# EAGLE design XRP_Controller (EAGLE 9.6.2)
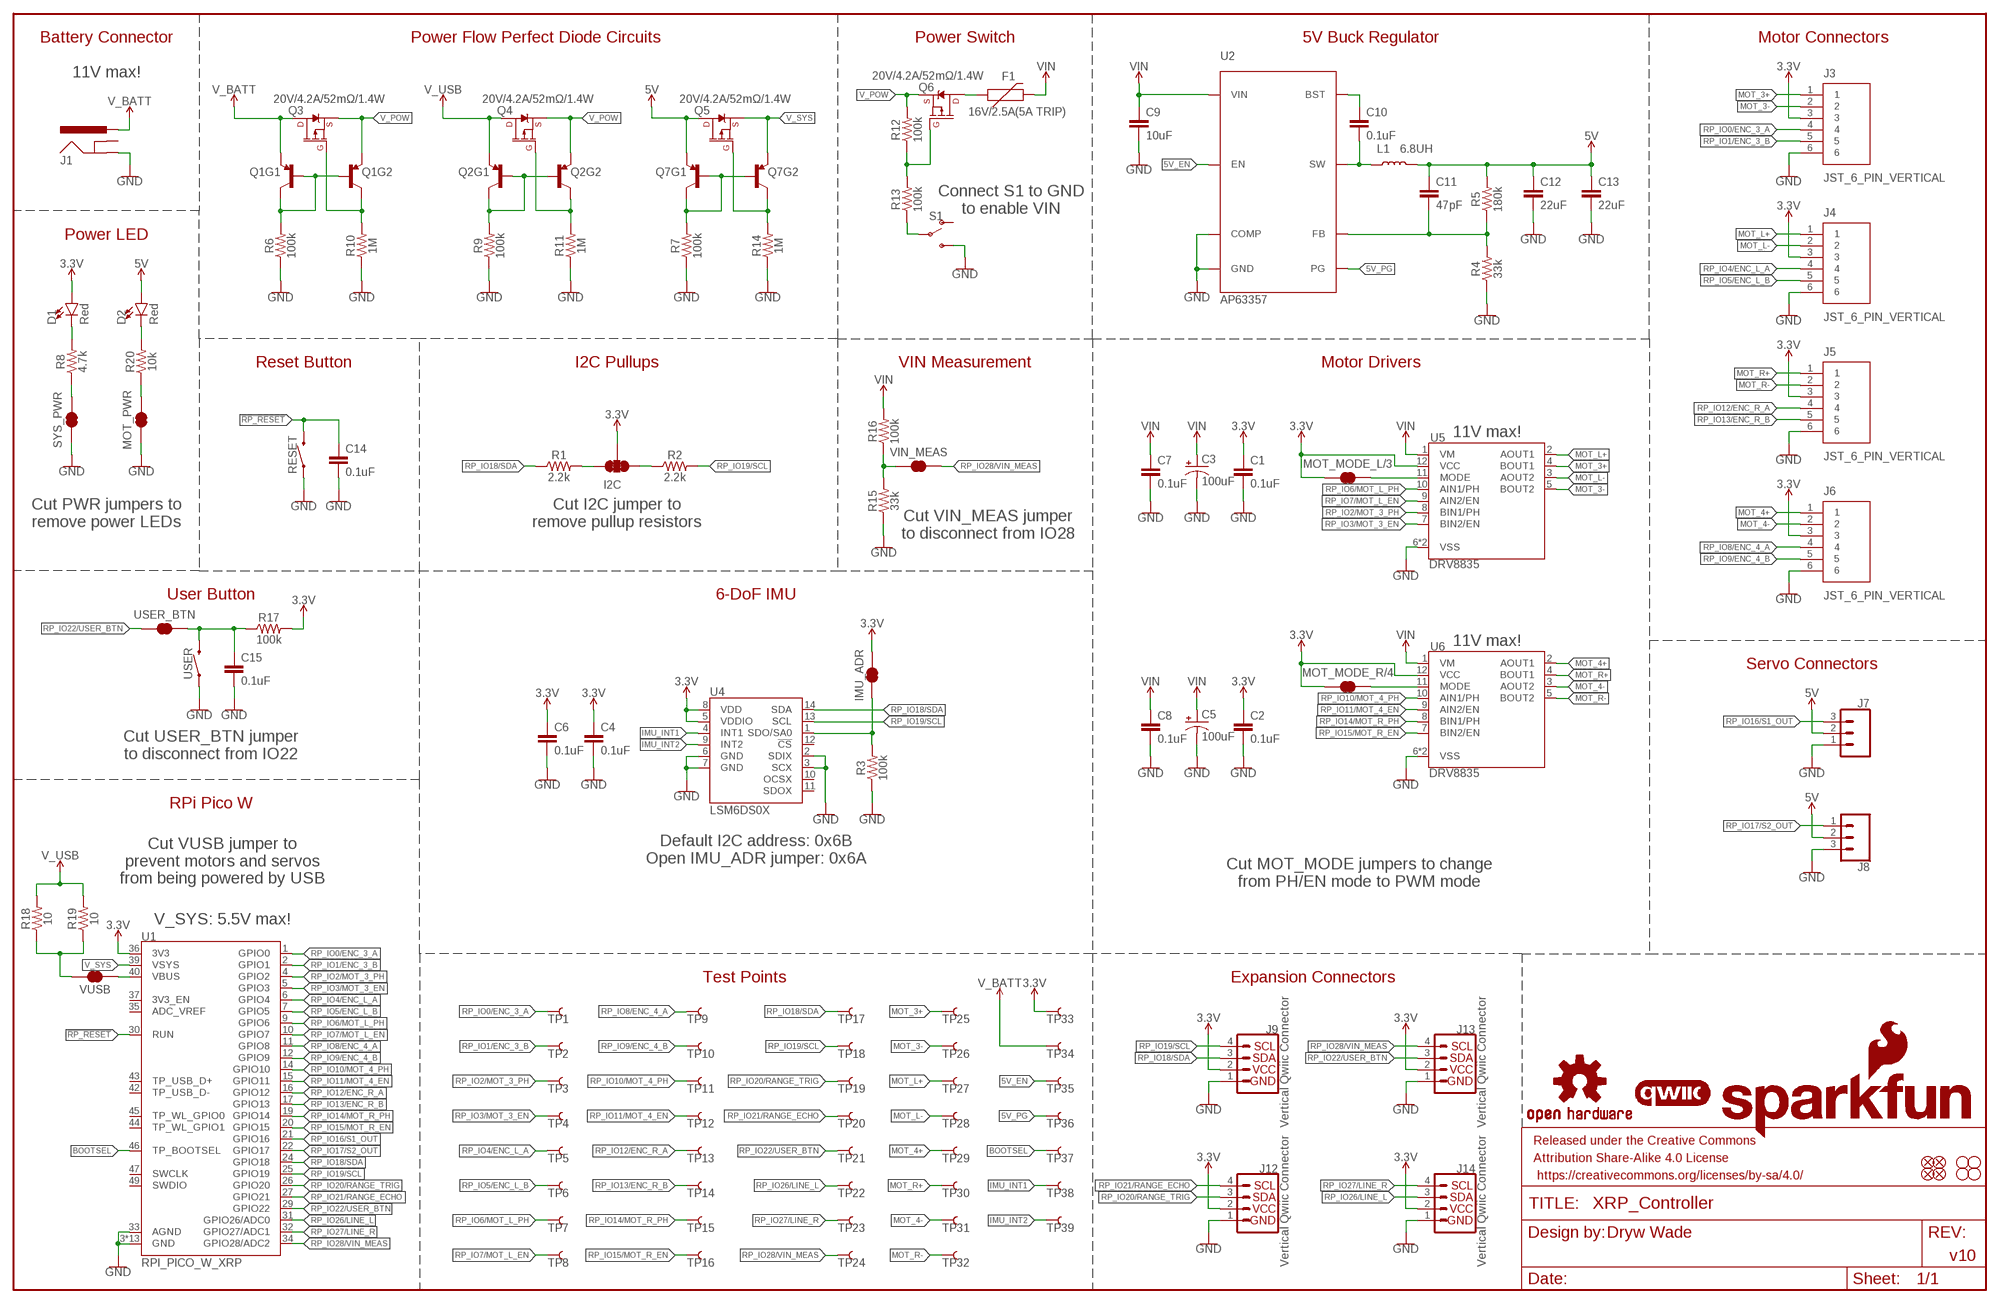
[diagram p0: schematic, sheet 1]

## Parts
C1  0.1uF  0.1UF-0603-25V-(+80/-20%)  [0603]
C2  0.1uF  0.1UF-0603-25V-(+80/-20%)  [0603]
C3  100uF  100UF-POLAR-25V-20%-SMD(ELEC)  [PANASONIC_D]
C4  0.1uF  0.1UF-0603-25V-(+80/-20%)  [0603]
C5  100uF  100UF-POLAR-25V-20%-SMD(ELEC)  [PANASONIC_D]
C6  0.1uF  0.1UF-0603-25V-(+80/-20%)  [0603]
C7  0.1uF  0.1UF-0603-25V-(+80/-20%)  [0603]
C8  0.1uF  0.1UF-0603-25V-(+80/-20%)  [0603]
C9  10uF  10UF-0805-25V-10%  [0805]
C10  0.1uF  0.1UF-0603-25V-(+80/-20%)  [0603]
C11  47pF  47PF-0603-50V-5%  [0603]
C12  22uF  22UF-0805-16V-20%  [0805]
C13  22uF  22UF-0805-16V-20%  [0805]
C14  0.1uF  0.1UF-0603-25V-(+80/-20%)  [0603]
C15  0.1uF  0.1UF-0603-25V-(+80/-20%)  [0603]
D1  Red  LED-RED_0603-KB  [LED-0603]
D2  Red  LED-RED_0603-KB  [LED-0603]
F1  16V/2.5A(5A TRIP)  PPTC_16V_2.5A  [1812]
FD1  FIDUCIAL1X2  [FIDUCIAL-1X2]
FD2  FIDUCIAL1X2  [FIDUCIAL-1X2]
FD3  FIDUCIAL1X2  [FIDUCIAL-1X2]
FD4  FIDUCIAL1X2  [FIDUCIAL-1X2]
FRAME1  FRAME-LEDGER  [CREATIVE_COMMONS]
H1  STAND-OFF  [STAND-OFF]
H2  STAND-OFF  [STAND-OFF]
H3  STAND-OFF  [STAND-OFF]
H4  STAND-OFF  [STAND-OFF]
I2C  JUMPER-SMT_3_2-NC_TRACE_SILK  [SMT-JUMPER_3_2-NC_TRACE_SILK]
IMU_ADR  JUMPER-SMT_2_NC_TRACE_SILK  [SMT-JUMPER_2_NC_TRACE_SILK]
J1  POWER_JACKPOWER_JACK_SLOT  [POWER_JACK_PTH_SLOT]
J3  JST_6_PIN_VERTICAL  [JST-6-SMD-VERT-1.0MM]
J4  JST_6_PIN_VERTICAL  [JST-6-SMD-VERT-1.0MM]
J5  JST_6_PIN_VERTICAL  [JST-6-SMD-VERT-1.0MM]
J6  JST_6_PIN_VERTICAL  [JST-6-SMD-VERT-1.0MM]
J7  CONN_03LOCK_NO_SILK  [1X03_LOCK_NO_SILK]
J8  CONN_03LOCK_NO_SILK  [1X03_LOCK_NO_SILK]
J9  Vertical Qwiic Connector  QWIIC_CONNECTOR  [JST04_1MM_VERT]
J12  Vertical Qwiic Connector  QWIIC_CONNECTOR  [JST04_1MM_VERT]
J13  Vertical Qwiic Connector  QWIIC_CONNECTOR  [JST04_1MM_VERT]
J14  Vertical Qwiic Connector  QWIIC_CONNECTOR  [JST04_1MM_VERT]
L1  6.8UH  [07A7_6U8H]
LOGO1  OSHW-LOGOS  [OSHW-LOGO-S]
LOGO3  SFE_LOGO_NAME_FLAME.3_INCH  [SFE_LOGO_NAME_FLAME_.3]
MOT_MODE_L/3  JUMPER-SMT_2_NC_TRACE_SILK  [SMT-JUMPER_2_NC_TRACE_SILK]
MOT_MODE_R/4  JUMPER-SMT_2_NC_TRACE_SILK  [SMT-JUMPER_2_NC_TRACE_SILK]
MOT_PWR  JUMPER-SMT_2_NC_TRACE_SILK  [SMT-JUMPER_2_NC_TRACE_SILK]
Q1  TRANS_PNP_DUALSOT-363  [SOT363_PHILIPS]
Q2  TRANS_PNP_DUALSOT-363  [SOT363_PHILIPS]
Q3  20V/4.2A/52mΩ/1.4W  MOSFET_PCH-DMG2305UX-7  [SOT23-3]
Q4  20V/4.2A/52mΩ/1.4W  MOSFET_PCH-DMG2305UX-7  [SOT23-3]
Q5  20V/4.2A/52mΩ/1.4W  MOSFET_PCH-DMG2305UX-7  [SOT23-3]
Q6  20V/4.2A/52mΩ/1.4W  MOSFET_PCH-DMG2305UX-7  [SOT23-3]
Q7  TRANS_PNP_DUALSOT-363  [SOT363_PHILIPS]
R1  2.2k  2.2KOHM-0603-1/10W-1%  [0603]
R2  2.2k  2.2KOHM-0603-1/10W-1%  [0603]
R3  100k  100KOHM-0603-1/10W-1%  [0603]
R4  33k  33KOHM-0603-1/10W-1%  [0603]
R5  180k  180KOHM-0603-1/10W-1%  [0603]
R6  100k  100KOHM-0603-1/10W-1%  [0603]
R7  100k  100KOHM-0603-1/10W-1%  [0603]
R8  4.7k  4.7KOHM-0603-1/10W-1%  [0603]
R9  100k  100KOHM-0603-1/10W-1%  [0603]
R10  1M  1MOHM-0603-1/4W-5%  [0603]
R11  1M  1MOHM-0603-1/4W-5%  [0603]
R12  100k  100KOHM-0603-1/10W-1%  [0603]
R13  100k  100KOHM-0603-1/10W-1%  [0603]
R14  1M  1MOHM-0603-1/4W-5%  [0603]
R15  33k  33KOHM-0603-1/10W-1%  [0603]
R16  100k  100KOHM-0603-1/10W-1%  [0603]
R17  100k  100KOHM-0603-1/10W-1%  [0603]
R18  10  10OHM-1206-1/4W-1%  [1206]
R19  10  10OHM-1206-1/4W-1%  [1206]
R20  10k  10KOHM-0603-1/10W-1%  [0603]
RESET  MOMENTARY-SWITCH-SPST-SMD-4.6X2.8MM  [TACTILE_SWITCH_SMD_4.6X2.8MM]
S1  SWITCH-SPDT-SMD-RIGHT-ANGLE  [SWITCH_SPST_SMD_A]
SYS_PWR  JUMPER-SMT_2_NC_TRACE_SILK  [SMT-JUMPER_2_NC_TRACE_SILK]
TP1  TEST-POINT3X5  [PAD.03X.05]
TP2  TEST-POINT3X5  [PAD.03X.05]
TP3  TEST-POINT3X5  [PAD.03X.05]
TP4  TEST-POINT3X5  [PAD.03X.05]
TP5  TEST-POINT3X5  [PAD.03X.05]
TP6  TEST-POINT3X5  [PAD.03X.05]
TP7  TEST-POINT3X5  [PAD.03X.05]
TP8  TEST-POINT3X5  [PAD.03X.05]
TP9  TEST-POINT3X5  [PAD.03X.05]
TP10  TEST-POINT3X5  [PAD.03X.05]
TP11  TEST-POINT3X5  [PAD.03X.05]
TP12  TEST-POINT3X5  [PAD.03X.05]
TP13  TEST-POINT3X5  [PAD.03X.05]
TP14  TEST-POINT3X5  [PAD.03X.05]
TP15  TEST-POINT3X5  [PAD.03X.05]
TP16  TEST-POINT3X5  [PAD.03X.05]
TP17  TEST-POINT3X5  [PAD.03X.05]
TP18  TEST-POINT3X5  [PAD.03X.05]
TP19  TEST-POINT3X5  [PAD.03X.05]
TP20  TEST-POINT3X5  [PAD.03X.05]
TP21  TEST-POINT3X5  [PAD.03X.05]
TP22  TEST-POINT3X5  [PAD.03X.05]
TP23  TEST-POINT3X5  [PAD.03X.05]
TP24  TEST-POINT3X5  [PAD.03X.05]
TP25  TEST-POINT3X5  [PAD.03X.05]
TP26  TEST-POINT3X5  [PAD.03X.05]
TP27  TEST-POINT3X5  [PAD.03X.05]
TP28  TEST-POINT3X5  [PAD.03X.05]
TP29  TEST-POINT3X5  [PAD.03X.05]
TP30  TEST-POINT3X5  [PAD.03X.05]
TP31  TEST-POINT3X5  [PAD.03X.05]
TP32  TEST-POINT3X5  [PAD.03X.05]
TP33  TEST-POINT3X5  [PAD.03X.05]
TP34  TEST-POINT3X5  [PAD.03X.05]
TP35  TEST-POINT3X5  [PAD.03X.05]
TP36  TEST-POINT3X5  [PAD.03X.05]
TP37  TEST-POINT3X5  [PAD.03X.05]
TP38  TEST-POINT3X5  [PAD.03X.05]
TP39  TEST-POINT3X5  [PAD.03X.05]
U1  RPI_PICO_W_XRP  [RPI_PICO_W]
U2  AP63357  [V-DFN3020-13]
U4  LSM6DS0X  LSM6DSOX_XRP  [LGA14L]
U5  DRV8835  DRV883X  [WSON-12]
U6  DRV8835  DRV883X  [WSON-12]
U$98  QWIIC_LOGO  [QWIIC_INVERTED]
USER  MOMENTARY-SWITCH-SPST-SMD-4.6X2.8MM  [TACTILE_SWITCH_SMD_4.6X2.8MM]
USER_BTN  JUMPER-SMT_2_NC_TRACE_SILK  [SMT-JUMPER_2_NC_TRACE_SILK]
VIN_MEAS  JUMPER-SMT_2_NC_TRACE_SILK  [SMT-JUMPER_2_NC_TRACE_SILK]
VUSB  JUMPER-SMT_2_NC_TRACE_SILK  [SMT-JUMPER_2_NC_TRACE_SILK]

## Nets
3.3V: C1.1 C2.1 C4.1 C6.1 D1.A I2C.2 IMU_ADR.2 J3.3 J4.3 J5.3 J6.3 J9.2 J12.2 J13.2 J14.2 MOT_MODE_L/3.2 MOT_MODE_R/4.2 R17.2 TP33.1 U1.36(3V3) U4.5(VDDIO) U4.8(VDD) U5.12(VCC) U6.12(VCC)
5V: C11.1 C12.1 C13.1 D2.A J7.2 J8.2 L1.P$2 Q5.3(D) Q7.1(E) R5.2
5V_EN: TP35.1 U2.P$2(EN)
5V_PG: TP36.1 U2.P$5(PG)
!POW_EN!: R13.1 S1.2(P)
!RP_RESET!: C14.1 RESET.3 RESET.4 U1.30(RUN)
BOOTSEL: TP37.1 U1.46(TP_BOOTSEL)
FB: C11.2 R4.2 R5.1 U2.P$3(FB)
GND: C1.2 C2.2 C3.- C4.2 C5.- C6.2 C7.2 C8.2 C9.2 C12.2 C13.2 C14.2 C15.2 J1.GND J3.6 J4.6 J5.6 J6.6 J7.1 J8.3 J9.1 J12.1 J13.1 J14.1 MOT_PWR.1 R3.1 R4.1 R6.1 R7.1 R9.1 R10.1 R11.1 R14.1 R15.1 RESET.1 RESET.2 S1.3(S) SYS_PWR.1 U1.3(GND) U1.8(GND) U1.13(GND) U1.18(GND) U1.23(GND) U1.28(GND) U1.33(AGND) U1.38(GND) U1.41(GND) U1.48(GND) U1.A(GND) U1.B(GND) U1.C(GND) U1.D(GND) U2.P$4(COMP) U2.P$8(GND) U4.2(SDIX) U4.3(SCX) U4.6(GND) U4.7(GND) U5.6(VSS) U5.PAD(VSS) U6.6(VSS) U6.PAD(VSS) USER.1 USER.2
IMU_INT1: TP38.1 U4.4(INT1)
IMU_INT2: TP39.1 U4.9(INT2)
MOT_3+: J3.1 TP25.1 U5.4(BOUT1)
MOT_3-: J3.2 TP26.1 U5.5(BOUT2)
MOT_4+: J6.1 TP29.1 U6.2(AOUT1)
MOT_4-: J6.2 TP31.1 U6.3(AOUT2)
MOT_L+: J4.1 TP27.1 U5.2(AOUT1)
MOT_L-: J4.2 TP28.1 U5.3(AOUT2)
MOT_R+: J5.1 TP30.1 U6.4(BOUT1)
MOT_R-: J5.2 TP32.1 U6.5(BOUT2)
N$1: D1.C R8.2
N$2: IMU_ADR.1 R3.2 U4.1(SDO/SA0)
N$3: I2C.3 R1.2
N$4: I2C.1 R2.1
N$5: C10.1 U2.P$6(BST)
N$6: Q1.2(B) Q1.5(B) Q1.6(C) R6.2
N$7: Q1.3(C) Q3.1(G) R10.2
N$8: F1.1 Q6.3(D)
N$9: U1.40(VBUS) VUSB.2
N$10: R8.1 SYS_PWR.2
N$11: Q2.2(B) Q2.5(B) Q2.6(C) R9.2
N$12: R15.2 R16.1 VIN_MEAS.2
N$13: MOT_MODE_L/3.1 U5.11(MODE)
N$14: MOT_MODE_R/4.1 U6.11(MODE)
N$15: Q6.1(G) R12.1 R13.2
N$16: Q2.3(C) Q4.1(G) R11.2
N$17: C15.1 R17.1 USER.3 USER.4 USER_BTN.1
N$18: R18.1 R19.1 VUSB.1
N$19: Q7.2(B) Q7.5(B) Q7.6(C) R7.2
N$20: Q5.1(G) Q7.3(C) R14.2
N$21: D2.C R20.2
N$22: MOT_PWR.2 R20.1
RP_IO0/ENC_3_A: J3.4 TP1.1 U1.1(GPIO0)
RP_IO1/ENC_3_B: J3.5 TP2.1 U1.2(GPIO1)
RP_IO2/MOT_3_PH: TP3.1 U1.4(GPIO2) U5.8(BIN1/PH)
RP_IO3/MOT_3_EN: TP4.1 U1.5(GPIO3) U5.7(BIN2/EN)
RP_IO4/ENC_L_A: J4.4 TP5.1 U1.6(GPIO4)
RP_IO5/ENC_L_B: J4.5 TP6.1 U1.7(GPIO5)
RP_IO6/MOT_L_PH: TP7.1 U1.9(GPIO6) U5.10(AIN1/PH)
RP_IO7/MOT_L_EN: TP8.1 U1.10(GPIO7) U5.9(AIN2/EN)
RP_IO8/ENC_4_A: J6.4 TP9.1 U1.11(GPIO8)
RP_IO9/ENC_4_B: J6.5 TP10.1 U1.12(GPIO9)
RP_IO10/MOT_4_PH: TP11.1 U1.14(GPIO10) U6.10(AIN1/PH)
RP_IO11/MOT_4_EN: TP12.1 U1.15(GPIO11) U6.9(AIN2/EN)
RP_IO12/ENC_R_A: J5.4 TP13.1 U1.16(GPIO12)
RP_IO13/ENC_R_B: J5.5 TP14.1 U1.17(GPIO13)
RP_IO14/MOT_R_PH: TP15.1 U1.19(GPIO14) U6.8(BIN1/PH)
RP_IO15/MOT_R_EN: TP16.1 U1.20(GPIO15) U6.7(BIN2/EN)
RP_IO16/S1_OUT: J7.3 U1.21(GPIO16)
RP_IO17/S2_OUT: J8.1 U1.22(GPIO17)
RP_IO18/SDA: J9.3 R1.1 TP17.1 U1.24(GPIO18) U4.14(SDA)
RP_IO19/SCL: J9.4 R2.2 TP18.1 U1.25(GPIO19) U4.13(SCL)
RP_IO20/RANGE_TRIG: J12.3 TP19.1 U1.26(GPIO20)
RP_IO21/RANGE_ECHO: J12.4 TP20.1 U1.27(GPIO21)
RP_IO22/USER_BTN: J13.3 TP21.1 U1.29(GPIO22) USER_BTN.2
RP_IO26/LINE_L: J14.3 TP22.1 U1.31(GPIO26/ADC0)
RP_IO27/LINE_R: J14.4 TP23.1 U1.32(GPIO27/ADC1)
RP_IO28/VIN_MEAS: J13.4 TP24.1 U1.34(GPIO28/ADC2) VIN_MEAS.1
SW: C10.2 L1.P$1 U2.P$7(SW) U2.P$9(SW)
V_BATT: J1.PWR Q1.1(E) Q3.3(D) TP34.1
V_POW: Q1.4(E) Q2.4(E) Q3.2(S) Q4.2(S) Q6.2(S) R12.2
V_SYS: Q5.2(S) Q7.4(E) U1.39(VSYS)
V_USB: Q2.1(E) Q4.3(D) R18.2 R19.2
VIN: C3.+ C5.+ C7.1 C8.1 C9.1 F1.2 R16.2 U2.P$1(VIN) U5.1(VM) U6.1(VM)
Unconnected: J1.GNDBREAK S1.1(O) U1.35(ADC_VREF) U1.37(3V3_EN) U1.42(TP_USB_D-) U1.43(TP_USB_D+) U1.44(TP_WL_GPIO1) U1.45(TP_WL_GPIO0) U1.47(SWCLK) U1.49(SWDIO) U4.10(OCSX) U4.11(SDOX) U4.12(!CS!)

## Notes on the sheet
- Battery Connector | Power Flow Perfect Diode Circuits | Power Switch | 5V Buck Regulator | Motor Connectors
- 11V max!
- Connect S1 to GND
  to enable VIN
- Power LED
- Reset Button | I2C Pullups | VIN Measurement | Motor Drivers
- 11V max!
- Cut PWR jumpers to
  remove power LEDs
- Cut I2C jumper to
  remove pullup resistors
- Cut VIN_MEAS jumper
  to disconnect from IO28
- User Button | 6-DoF IMU
- 11V max!
- Servo Connectors
- Cut USER_BTN jumper
  to disconnect from IO22
- RPi Pico W
- Default I2C address: 0x6B
  Open IMU_ADR jumper: 0x6A
- Cut VUSB jumper to
  prevent motors and servos
  from being powered by USB
- Cut MOT_MODE jumpers to change
  from PH/EN mode to PWM mode
- V_SYS: 5.5V max!
- Test Points | Expansion Connectors
- Dryw Wade
- v10

## Library data of the parts
C1 C2 C4 C6-C8 C10 C14 C15 = SparkFun-Capacitors:0.1UF: 0.1µF ceramic capacitors A capacitor is a passive two-terminal electrical component used to store electrical energy temporarily in an electric field.; PROD_ID: CAP-00810
C3 C5 = SparkFun-Capacitors:100UF-POLAR: 100µF polarized capacitors A capacitor is a passive two-terminal electrical component used to store electrical energy temporarily in an electric field.; PN: EDH107M025A9HAA; PROD_ID: CAP-17222
C9 = SparkFun-Capacitors:10UF: 10.0µF ceramic capacitors A capacitor is a passive two-terminal electrical component used to store electrical energy temporarily in an electric field.; PROD_ID: CAP-14259
C11 = SparkFun-Capacitors:47PF: 47pF ceramic capacitors A capacitor is a passive two-terminal electrical component used to store electrical energy temporarily in an electric field.; PROD_ID: CAP-08913
C12 C13 = SparkFun-Capacitors:22UF: 22µF ceramic capacitors A capacitor is a passive two-terminal electrical component used to store electrical energy temporarily in an electric field.; PROD_ID: CAP-14260
D1 D2 = SparkFun-LED:LED-RED: Red SMD LED Used in manufacturing of most products at SparkFun Packages: 0603 - KB - KingBright (DIO-17976) SMD 0603 package [Datasheet] <https://www.kingbrightusa.com/images/catalog/SPEC/APT1608SURCK.pdf> 0603 - (DIO-00819, has gone EOL) SMD 0603 package 0603 SMART - SMD 0603 SMART package ( more efficient and expensive)[Product Link] <http://www.osram-os.com/Graphics/XPic2/00077099_0.pdf> 1206 - SMD1206 package [Product Link] <https://www.sparkfun.com/datasheets/DevTools/LilyPad/Q150OVS4.pdff> SparkFun Products: Pro Mini 328 -5V <https://www.sparkfun.com/products/821> RedBoard <https://www.sparkfun.com/products/12757> IOIO-OTG <https://www.sparkfun.com/products/13613>; PROD_ID: DIO-17976
F1 = SparkFun-Fuses:PPTC: Resettable Fuse PPTC Resettable Fuse. Really a sort of resistor with a polymeric positive temperature coefficient whose resistance increases dramatically with an increase in temperature. When heated by the power passing through the resistance rises causing the current to be limited, protecting the circuit. This is achieved by the transition of the polymer from a crystalline to an amorphous state where the conductive carbon separates breaking the conductive pathways found in the cool crystalline structure. When a PPTC cools back down it resumes conducting letting the circuit turn back on. SparkFun Products: SparkFun RedBoard - Programmed with Arduino <https://www.sparkfun.com/products/12757> Pro Micro - 5V/16MHz <https://www.sparkfun.com/products/12640> Arduino Pro 328 - 5V/16MHz <https://www.sparkfun.com/products/10915> MP3 Trigger <https://www.sparkfun.com/products/13720>; PROD_ID: RES-14390
FD1-FD4 = SparkFun-Aesthetics:FIDUCIAL: Fiducial Alignment Points Point-of-reference for pick-and-place machines and other optical instruments.
FRAME1 = SparkFun-Aesthetics:FRAME-LEDGER: Schematic Frame - Ledger Standard 11x14 US Ledger frame
H1-H4 = SparkFun-Hardware:STAND-OFF: Stand Off Drill holes for mechanically mounting via screws, standoffs, etc. Note: Use the keepout ring to avoid running the screw head into surrounding components. Variant Overviews STAND-OFF - Mechanical footprint for a #4 phillips button head screw. STAND-OFF-TIGHT - Mechanical footprint for a #4 phillips button head screw, Example SparkFun Products Screw - Phillips Head (1/4", 4-40, 10 pack) <https://www.sparkfun.com/products/10453> (PRT-10453) Screw - Phillips Head (1/2", 4-40, 10 pack) <https://www.sparkfun.com/products/10452> (PRT-10452) Screw - Phillips Head (3/4", 4-40, 10 pack) <https://www.sparkfun.com/products/10451> (PRT-10451) Screw - Phillips Head (1", 4-40, 10 pack) <https://www.sparkfun.com/products/10450> (PRT-10450)
I2C = SparkFun-Jumpers:JUMPER-SMT_3_2-NC_TRACE: Normally closed trace jumper (2 of 2 connections) This jumper has a trace between all three pads so they are normally closed (NC). Use a razor knife to open the connection(s). For best results follow the IPC guidelines for cutting traces: Cutout at least 0.063 mm (0.005 in). Remove all loose material to clean up the cut area. Seal the cut with an approved epoxy. Reapply solder to reclose the connection(s).
IMU_ADR MOT_MODE_L/3 MOT_MODE_R/4 MOT_PWR SYS_PWR USER_BTN VIN_MEAS VUSB = SparkFun-Jumpers:JUMPER-SMT_2_NC_TRACE: Normally closed trace jumper This jumper has a trace between two pads so it's normally closed (NC). Use a razor knife to open the connection. For best results follow the IPC guidelines for cutting traces: Cutout at least 0.063 mm (0.005 in). Remove all loose material to clean up the cut area. Seal the cut with an approved epoxy. Reapply solder to reclose the connection.
J1 = SparkFun-Connectors:POWER_JACK: Power Jack Connector This is the standard 5.5mm barrel jack for power. The PTH is the most common, proven, reliable, footprint. The Slot footprint only works if the mill layer is transmitted to the PCB fab house so be warned. Here are the connectors we sell at SparkFun: DC Barrel Power Jack/Connector <https://www.sparkfun.com/products/119> (PRT-00119) DC Barrel Power Jack/Connector (SMD) <https://www.sparkfun.com/products/12748> (PRT-12748) DC Barrel Jack Adapter - Breadboard Compatible <https://www.sparkfun.com/products/10811> (PRT-10811) It is used on this SparkFun product (and many, many others): SparkFun RedBoard - Programmed with Arduino <https://www.sparkfun.com/products/12757> (DEV-12757) Also, if you need a mating power supply or connector, please check these out: Wall Adapter Power Supply - 9VDC 650mA <https://www.sparkfun.com/products/298> (TOL-00298) DC Barrel Jack Adapter - Male <https://www.sparkfun.com/products/10287> (PRT-10287); PROD_ID: CONN-08197
J3-J6 = SparkFun-Connectors:JST_6_PIN_VERTICAL: JST 6 pin vertical connector Here is a six pin vertical 1.0mm pitch connector. It is useful if you need something very tiny as a connection. These are not the standard JST type connectors we use on most of our boards, but are actually the much smaller JST-SH type. Here is the connector we sell at SparkFun: JST SH Vertical 6-Pin Connector - SMD <https://www.sparkfun.com/products/579> (GPS-00579) Datasheet <http://www.sparkfun.com/datasheets/GPS/EM406-SMDConnector-eSH.pdf> It was used on these SparkFun products: SparkFun GPS Breakout <https://www.sparkfun.com/products/11818> (BOB-11818) SparkFun Weather Shield <https://www.sparkfun.com/products/12081> (DEV-12081) And many, many other GPS related products.; PROD_ID: CONN-08249; SF_ID: GPS-00579
J7 J8 = SparkFun-Connectors:CONN_03: Multi connection point. Often used as Generic Header-pin footprint for 0.1 inch spaced/style header connections On any of the 0.1 inch spaced packages, you can populate with these: Break Away Headers - Straight <https://www.sparkfun.com/products/116> (PRT-00116) Break Away Male Headers - Right Angle <https://www.sparkfun.com/products/553> (PRT-00553) Female Headers <https://www.sparkfun.com/products/115> (PRT-00115) Break Away Headers - Machine Pin <https://www.sparkfun.com/products/117> (PRT-00117) Break Away Female Headers - Swiss Machine Pin <https://www.sparkfun.com/products/743> (PRT-00743) Stackable Header - 3 Pin (Female, 0.1") <https://www.sparkfun.com/products/13875> (PRT-13875) For SCREWTERMINALS and SPRING TERMINALS visit here: Screw Terimnals on SparkFun.com <https://www.sparkfun.com/search/results?term=Screw+Terminals> (5mm/3.5mm/2.54mm spacing) This device is also useful as a general connection point to wire up your design to another part of your project. Our various solder wires solder well into these plated through hole pads. Hook-Up Wire - Assortment (Stranded, 22 AWG) <https://www.sparkfun.com/products/11375> (PRT-11375) Hook-Up Wire - Assortment (Solid Core, 22 AWG) <https://www.sparkfun.com/products/11367> (PRT-11367) View the entire wire category on our website here <https://www.sparkfun.com/categories/141> Special notes: Molex polarized connector foot print use with SKU : PRT-08232 with associated crimp pins and housings.
J9 J12-J14 = SparkFun-Connectors:QWIIC_CONNECTOR: SparkFun I2C Standard Qwiic Connector An SMD 1mm pitch JST connector makes it easy and quick (get it? Qwiic?) to connect I2C devices to each other. The Qwiic system <http://www.sparkfun.com/qwiic> enables fast and solderless connection between popular platforms and various sensors and actuators. We carry 200mm <https://www.sparkfun.com/products/14204>, 100mm <https://www.sparkfun.com/products/14205>, 50mm <https://www.sparkfun.com/products/14206>, and breadboard friendly <https://www.sparkfun.com/products/14207> Qwiic cables. We also offer 10 pcs strips <https://www.sparkfun.com/products/14323> the SMD connectors.; PROD_ID: CONN-14483
L1 = Buck5V:6.8UH; PN: LMLP07A7M6R8DTAS; PROD_ID: NDUC-17223
LOGO1 = SparkFun-Aesthetics:OSHW-LOGO: Open-Source Hardware (OSHW) Logo This logo indicates the piece of hardware it is found on incorporates a OSHW license and/or adheres to the definition of open source hardware found here: http://freedomdefined.org/OSHW
LOGO3 = SparkFun-Aesthetics:SFE_LOGO_NAME_FLAME: SparkFun Font Logo w/ Flame This is the SparkFun full logo. The logo on the schematic will always be the same size; the package variant is the height of the flame part of the logo. Default layer for the logo on the board is tSilk.
Q1 Q2 Q7 = SparkFun-DiscreteSemi:TRANS_PNP_DUAL: Dual PNP Transistors in Single Package The BCM857BS puts two PNP transistors in a single package. Bipolar (BJT) Transistor Array 2 PNP (Dual) 45V 100mA 100MHz 200mW Surface Mount SOT-363 Datasheet <https://www.diodes.com/assets/Datasheets/BCM857BS.pdf> SparkFun Products: SparkFun Pi Servo HAT V2 <https://www.sparkfun.com>; PROD_ID: TRANS-14386
Q3-Q6 = SparkFun-DiscreteSemi:MOSFET_PCH: P-channel MOSFETs Voltage controlled devices that allow control of high current outputs. SparkFun Products: SparkFun ESP32 Thing <https://www.sparkfun.com/products/13907> SparkFun ESP8266 Thing <https://www.sparkfun.com/products/13231> SparkFun Pi Servo HAT V2 <https://www.sparkfun.com/products/15316> DMG2305UX-7 (20V/4.2A/SOT23-3); PROD_ID: TRANS-14388
R1 R2 = SparkFun-Resistors:2.2KOHM: 2.2kΩ resistor A resistor is a passive two-terminal electrical component that implements electrical resistance as a circuit element. Resistors act to reduce current flow, and, at the same time, act to lower voltage levels within circuits. - Wikipedia; PROD_ID: RES-08272
R3 R6 R7 R9 R12 R13 R16 R17 = SparkFun-Resistors:100KOHM: 100kΩ resistor A resistor is a passive two-terminal electrical component that implements electrical resistance as a circuit element. Resistors act to reduce current flow, and, at the same time, act to lower voltage levels within circuits. - Wikipedia; PROD_ID: RES-07828
R4 R15 = SparkFun-Resistors:33KOHM: 33kΩ resistor A resistor is a passive two-terminal electrical component that implements electrical resistance as a circuit element. Resistors act to reduce current flow, and, at the same time, act to lower voltage levels within circuits. - Wikipedia; PROD_ID: RES-08416
R5 = SparkFun-Resistors:180KOHM: 180kΩ resistor A resistor is a passive two-terminal electrical component that implements electrical resistance as a circuit element. Resistors act to reduce current flow, and, at the same time, act to lower voltage levels within circuits. - Wikipedia; PROD_ID: RES-10066
R8 = SparkFun-Resistors:4.7KOHM: 4.7kΩ resistor A resistor is a passive two-terminal electrical component that implements electrical resistance as a circuit element. Resistors act to reduce current flow, and, at the same time, act to lower voltage levels within circuits. - Wikipedia; PROD_ID: RES-07857
R10 R11 R14 = SparkFun-Resistors:1MOHM: 1MΩ resistor A resistor is a passive two-terminal electrical component that implements electrical resistance as a circuit element. Resistors act to reduce current flow, and, at the same time, act to lower voltage levels within circuits. - Wikipedia; PROD_ID: RES-07868
R18 R19 = SparkFun-Resistors:10OHM: 10Ω resistor A resistor is a passive two-terminal electrical component that implements electrical resistance as a circuit element. Resistors act to reduce current flow, and, at the same time, act to lower voltage levels within circuits. - Wikipedia; PROD_ID: RES-08705
R20 = SparkFun-Resistors:10KOHM: 10kΩ resistor A resistor is a passive two-terminal electrical component that implements electrical resistance as a circuit element. Resistors act to reduce current flow, and, at the same time, act to lower voltage levels within circuits. - Wikipedia; PROD_ID: RES-00824
RESET USER = SparkFun-Switches:MOMENTARY-SWITCH-SPST: Momentary Switch (Pushbutton) - SPST Normally-open (NO) SPST momentary switches (buttons, pushbuttons). Variants PTH-12MM - 12mm square, through-hole Momentary Pushbutton Switch - 12mm Square <https://www.sparkfun.com/products/9190> (COM-09190) PTH-6.0MM, PTH-6.0MM-KIT - 6.0mm square, through-hole Mini Pushbutton Switch <https://www.sparkfun.com/products/97> (COM-00097) KIT package intended for soldering kit's - only one side of pads' copper is exposed. PTH-RIGHT-ANGLE-KIT - Right-angle, through-hole Right Angle Tactile Button <https://www.sparkfun.com/products/10791> - Used on SparkFun BigTime Watch Kit <https://www.sparkfun.com/products/11734> SMD-12MM - 12mm square, surface-mount Tactile Button - SMD (12mm) <https://www.sparkfun.com/products/12993> (COM-12993) Used on SparkFun PicoBoard <https://www.sparkfun.com/products/11888> SMD-4.5MM - 4.5mm Square Trackball Switch Used on SparkFun Blackberry Trackballer Breakout <https://www.sparkfun.com/products/13169> SMD-4.6MMX2.8MM - 4.60mm x 2.80mm, surface mount Used on SparkFun Pro Micro - RP2040 <https://www.sparkfun.com/products/17717> SMD-5.2MM, SMD-5.2-REDUNDANT - 5.2mm square, surface-mount Mini Pushbutton Switch - SMD <https://www.sparkfun.com/products/8720> (COM-08720) Used on Arduino Pro Mini <https://www.sparkfun.com/products/11114> REDUNDANT package connects both switch circuits together SMD-6.0X3.5MM - 6.0 x 3.5mm, surface mount Momentary Reset Switch SMD <https://www.sparkfun.com/products/8229> (COM-08229) SMD-6.2MM-TALL - 6.2mm square, surface mount Tactile Button - SMD (6mm) <https://www.sparkfun.com/products/12992> Used on SparkFun Digital Sandbox <https://www.sparkfun.com/products/12651> SMD-RIGHT-ANGLE - Right-angle, surface mount Used on SparkFun Block for Intel® Edison - Arduino <https://www.sparkfun.com/products/13036>; PROD_ID: SWCH-15606
S1 = SparkFun-Switches:SWITCH-SPDT: Single Pole, Double Throw (SPDT) Switch Single-pole, double-throw (SPDT) switch. Variant Overview SMD-AYZ0202 Surface Mount DPDT Switch <https://www.sparkfun.com/products/597> (COM-00597) Used on e.g. LilyPad Arduino USB - ATmega32U4 Board <https://www.sparkfun.com/products/12049> PTH-11.6X4.0MM SPDT Mini Power Switch <https://www.sparkfun.com/products/102> (COM-00102) Used on e.g. SparkFun Simon Says - Through-Hole Soldering Kit <https://www.sparkfun.com/products/10547> (KIT-10547) PTH-11.6X4.0MM-KIT KIT version of SPDT Mini Power Switch - Simplifies soldering by removing tStop of switch pins - only one side can be soldered. PTH-11.6X4.0MM-LOCK LOCK version of SPDT Mini Power Switch - Offset pins hold switch in place for easier soldering. SMD-RIGHT-ANGLE Surface Mount Right Angle Switch <https://www.sparkfun.com/products/10860> (COM-10860) Used on e.g. SparkFun ESP8266 Thing <https://www.sparkfun.com/products/13231>; PROD_ID: SWCH-10651; SF_SKU: COM-10860
TP1-TP39 = SparkFun-Connectors:TEST-POINT: SparkFun Test Points Bare copper test points for troubleshooting or In-Circuit-Testing. These are used by our Production team for verifying production board runs using pogo-pins on test beds. SparkFun Products: SparkFun LSM9DS1 Breakout <https://www.sparkfun.com/products/13284> SparkFun PSOC <https://www.sparkfun.com/products/13714> SparkFun Load Cell Amplifier <https://www.sparkfun.com/products/13879>
U1 = XRP_COMPONENTS:RPI_PICO_W_XRP; PROD_ID: COMP-18042
U2 = SparkFun-IC-Power:AP63357: The AP63356/AP63357 is a 3.5A, synchronous buck converter with a wide input voltage range of 3.8V to 32V. The device fully integrates a 74mΩ high-side power MOSFET and a 40mΩ low-side power MOSFET to provide high-efficiency step-down DC-DC conversion.; PN: AP63357DV-7; PROD_ID: VREG-17224
U4 = XRP_COMPONENTS:LSM6DSOX_XRP: The LSM6DSO is a system-in-package featuring a high-performance 3-axis digital accelerometer and 3-axis digital gyroscope.; PROD_ID: IC-18009
U5 U6 = SparkFun-IC-Special-Function:DRV883X: DRV8835 2 Channel Motor Driver Dual 1.5A H-bridge, 2-11V Datasheet <http://www.ti.com/lit/ds/symlink/drv8835.pdf> SparkFun Products: SparkFun Serial Controlled Motor Driver <https://www.sparkfun.com/products/13911>; PROD_ID: IC-13342
U$98 = XRP_COMPONENTS:QWIIC_LOGO

## Board
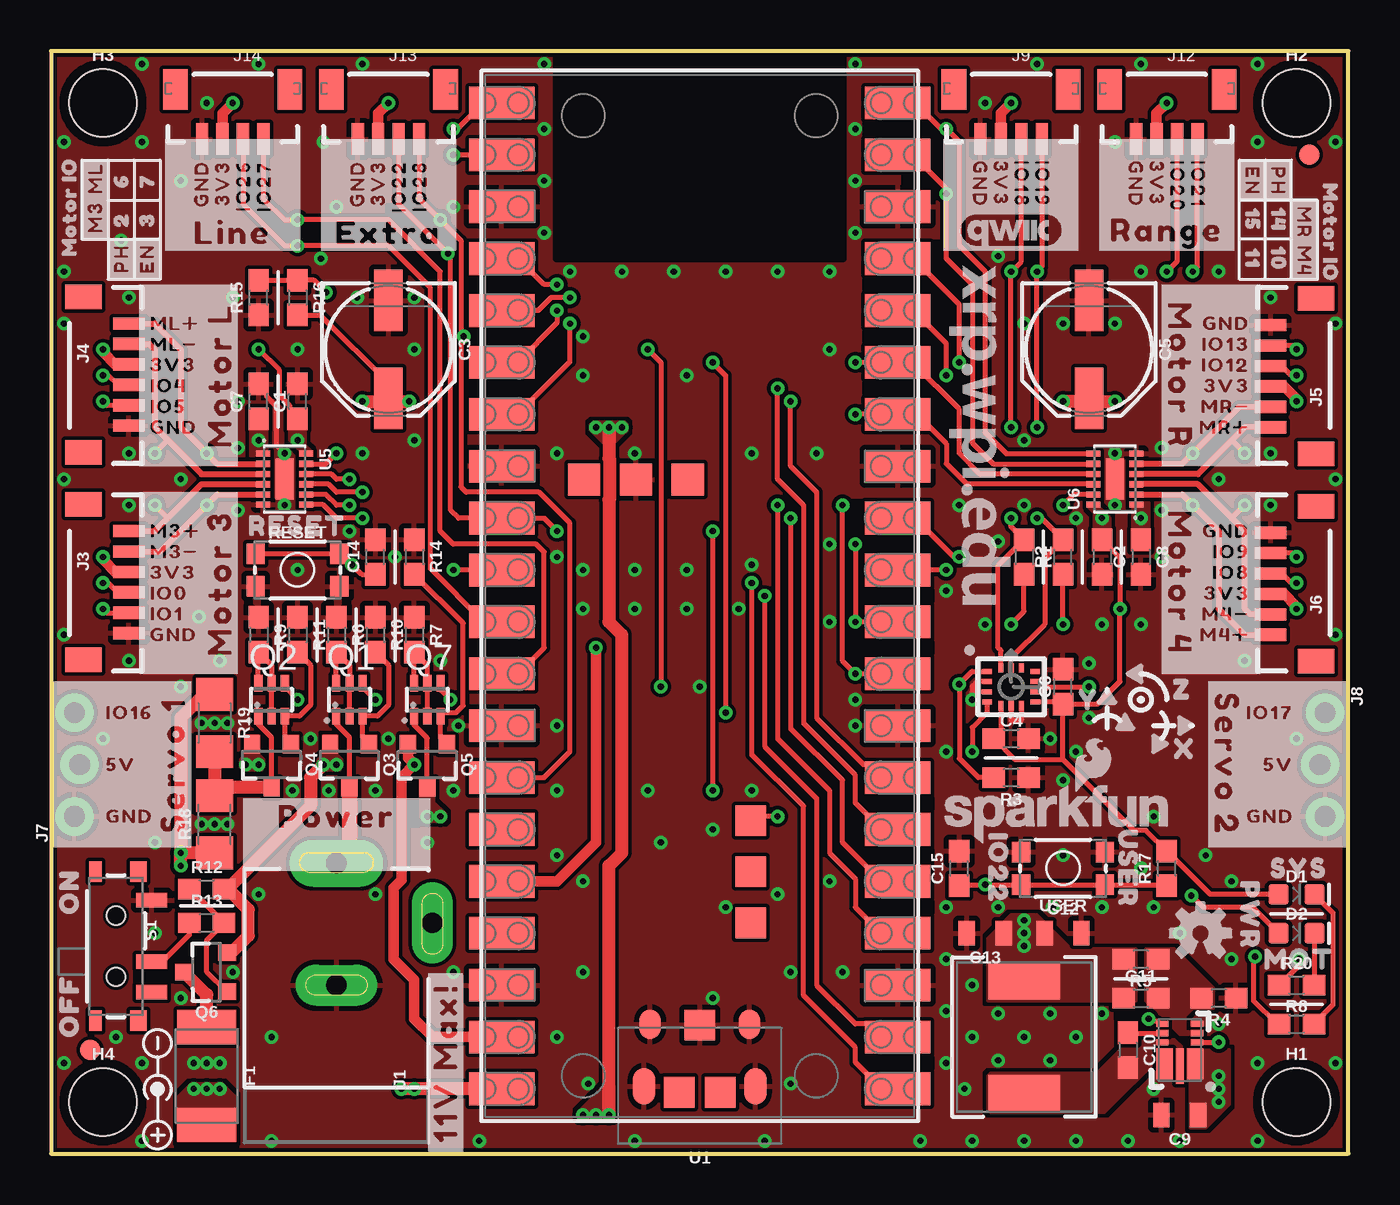
[diagram p1: board, top side]
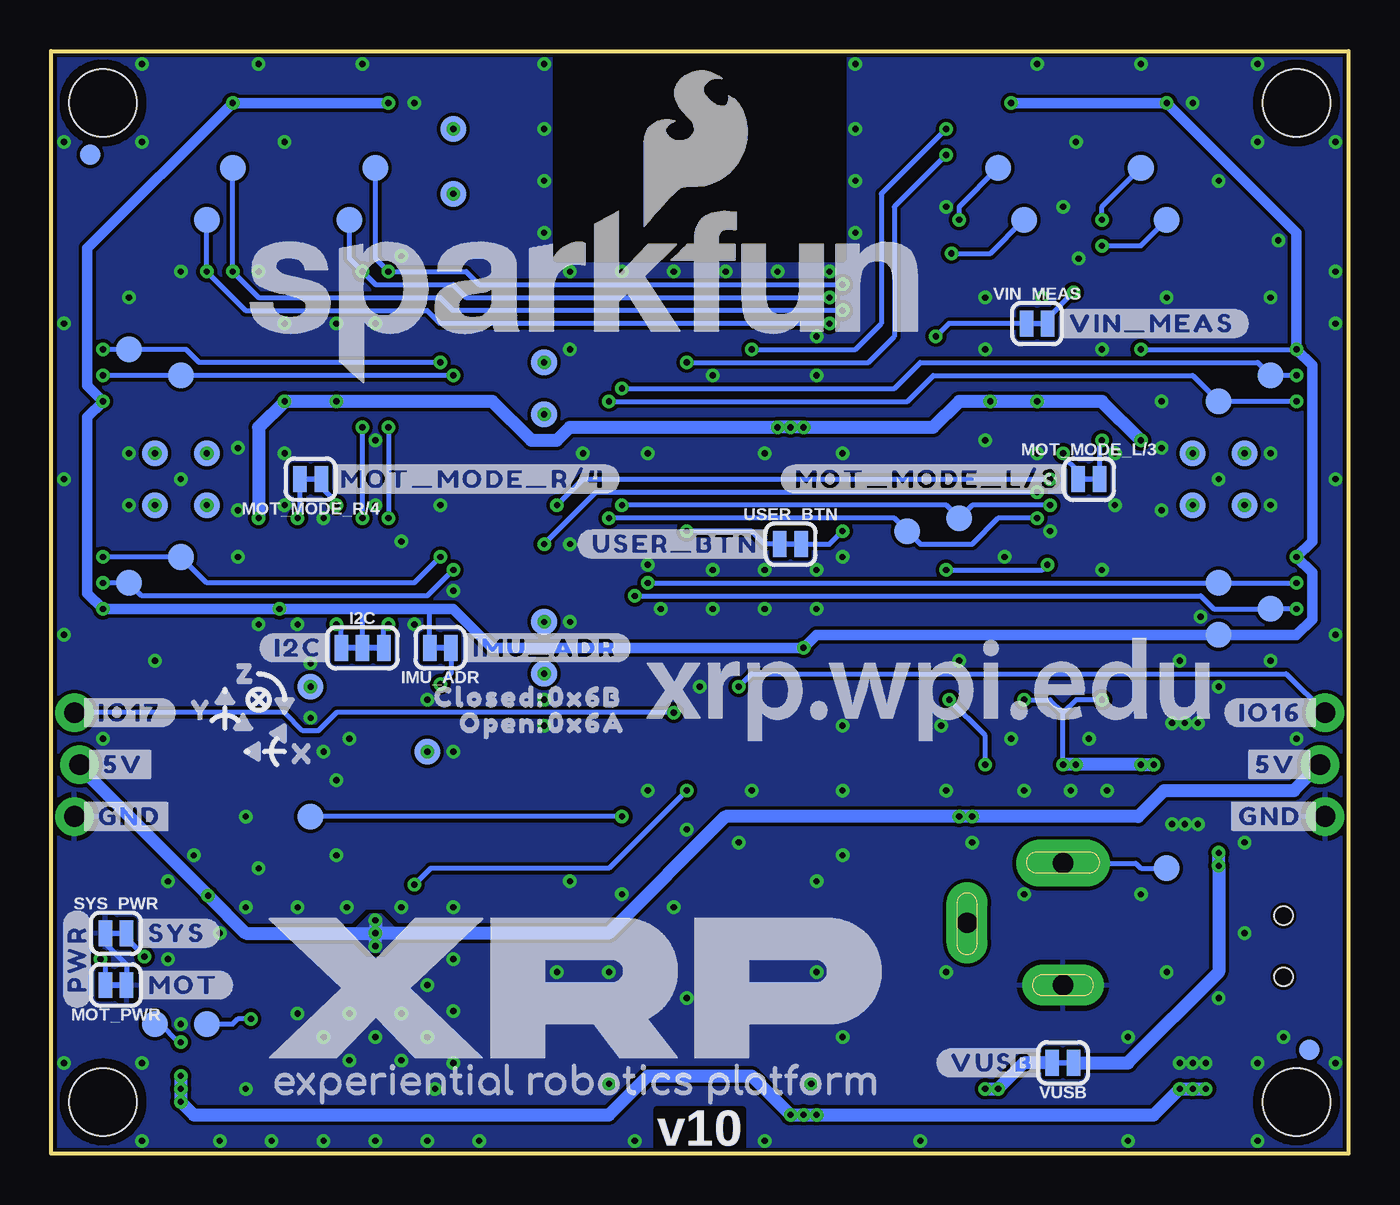
[diagram p2: board, bottom side, seen from below]

Size 63.5 x 53.98 mm. Coordinates in mm from the lower left corner, seen from the top.
Outline: 0,0 63.5,0 63.5,53.98 0,53.98 0,0
Copper layers (1*16): Top 0.035mm / dielectric 1.5mm / Bottom 0.035mm
Design rules "SparkFun-2-Layer-General-JLCPCB *": minimum track width 7mil, minimum drill 0.3mm, track to track 7mil, track to pad 6mil, pad to pad 7mil, via to via 7mil, smd to smd 7mil, copper to edge 7mil, drill to drill 7mil, minimum pad ring 7mil, minimum via ring 7mil, stop-mask expansion 3mil, vias tented up to drill 25mil, thermal gap 10mil
tRestrict: area 24.7,52.8 to 38.8,54; area 42.8,11.8 to 43.1,12.3; area 42.8,14.4 to 43.1,14.9; area 42.8,16.9 to 43.1,17.4; area 42.8,4.2 to 43.1,4.7; area 42.8,24.5 to 43.1,25; area 42.8,27.1 to 43.1,27.6; area 39.9,37.2 to 40.1,37.7; area 39.9,39.8 to 40.1,40.3; area 39.9,42.3 to 40.1,42.8; area 39.9,49.9 to 40.1,50.4; area 43.2,44.5 to 43.4,44.6; area 16.5,46.1 to 16.8,46.4; area 6.2,12.1 to 6.3,12.3; area 4.2,8.4 to 4.3,8.9; area 41.8,47.4 to 42,47.9; area 39.2,31.6 to 39.6,31.9; area 17.7,16.1 to 17.9,16.3; area 52.2,6.6 to 52.3,6.9
bRestrict: area 24.7,52.8 to 38.8,54

### Footprints (pad centres in the part's own frame; a part is rotated, then mirrored left to right if it is on the bottom)
0603 = smd 1.1 x 1: 1 -0.85,0; 2 0.85,0
PANASONIC_D = smd 3 x 1.4: + 2.4,0; - -2.4,0
0805 = smd 0.8 x 1.2: 1 -0.9,0; 2 0.9,0
LED-0603 = smd 1 x 1: A -0.877,0; C 0.877,0
1812 = smd 1.676 x 2.896: 1 -2.388,0; 2 2.388,0
FIDUCIAL-1X2 = smd 1 x 1: 1 0,0
STAND-OFF = hole 3.302: 0,0
SMT-JUMPER_3_2-NC_TRACE_SILK = smd 0.66 x 1.27: 1 -1.041,0; 2 0,0; 3 1.041,0
SMT-JUMPER_2_NC_TRACE_SILK = smd 0.66 x 1.27: 1 -0.521,0; 2 0.521,0
POWER_JACK_PTH_SLOT = drill 1 pad 2 long: GND 0,0; GNDBREAK -3.048,4.699 | drill 1 pad 2.3 long: PWR -5.969,0
JST-6-SMD-VERT-1.0MM = smd 0.6 x 1.55: 1 -2.54,1.27; 2 -1.54,1.27; 3 -0.54,1.27; 4 0.46,1.27; 5 1.46,1.27; 6 2.46,1.27 | smd 1.2 x 1.8: P$1 -3.84,-0.955; P$2 3.76,-0.955
1X03_LOCK_NO_SILK = drill 1.016 pad 1.88: 1 0,0.127; 2 2.54,-0.127; 3 5.08,0.127
JST04_1MM_VERT = smd 0.6 x 1.55: 1 -1.5,0.775; 2 -0.5,0.775; 3 0.5,0.775; 4 1.5,0.775 | smd 1.2 x 2: NC1 -2.8,3.2; NC2 2.8,3.2
07A7_6U8H = smd 1.85 x 3.5: P$1 -2.775,0; P$2 2.775,0
SOT363_PHILIPS = smd 0.4 x 0.8: 1 -0.65,-0.8; 2 0,-0.8; 3 0.65,-0.8; 4 0.65,0.8; 5 0,0.8; 6 -0.65,0.8
SOT23-3 = smd 0.8 x 0.9: 1 -0.95,-1; 2 0.95,-1; 3 0,1.1
1206 = smd 1.6 x 1.8: 1 -1.4,0; 2 1.4,0
TACTILE_SWITCH_SMD_4.6X2.8MM = smd 0.9 x 1: 1 -2.05,-0.8; 2 2.05,-0.8; 3 2.05,0.8; 4 -2.05,0.8
SWITCH_SPST_SMD_A = smd 0.7 x 1.5: 1 -2.25,-1.75; 2 -0.75,-1.75; 3 2.25,-1.75 | smd 1 x 0.6: GND1 -3.65,1; GND3 3.65,1 | smd 1 x 0.8: GND2 -3.65,-1.1; GND4 3.65,-1.1 | hole 0.9: -1.5,0; 1.5,0
PAD.03X.05 = smd 1.27 x 1.27: 1 0,0
RPI_PICO_W = smd 3.2 x 1.6: 1 -9.69,24.13; 2 -9.69,21.59; 3 -9.69,19.05; 4 -9.69,16.51; 5 -9.69,13.97; 6 -9.69,11.43; 7 -9.69,8.89; 8 -9.69,6.35; 9 -9.69,3.81; 10 -9.69,1.27; 11 -9.69,-1.27; 12 -9.69,-3.81; 13 -9.69,-6.35; 14 -9.69,-8.89; 15 -9.69,-11.43; 16 -9.69,-13.97; 17 -9.69,-16.51; 18 -9.69,-19.05; 19 -9.69,-21.59; 20 -9.69,-24.13; 21 9.69,-24.13; 22 9.69,-21.59; 23 9.69,-19.05; 24 9.69,-16.51; 25 9.69,-13.97; 26 9.69,-11.43; 27 9.69,-8.89; 28 9.69,-6.35; 29 9.69,-3.81; 30 9.69,-1.27; 31 9.69,1.27; 32 9.69,3.81; 33 9.69,6.35; 34 9.69,8.89; 35 9.69,11.43; 36 9.69,13.97; 37 9.69,16.51; 38 9.69,19.05; 39 9.69,21.59; 40 9.69,24.13 | smd 1.5 x 1.5: 41 0,21; 42 1,24.3; 43 -1,24.3; 44 -2.5,16; 45 -2.5,13.5; 46 -2.5,11 | smd 1.575 x 1.575: 47 0.584,-5.7; 48 3.124,-5.7; 49 5.664,-5.7 | smd 1.1 x 1.8: A -2.725,24; B 2.725,24 | smd 1.05 x 1.45: C -2.425,20.97; D 2.425,20.97
V-DFN3020-13 = smd 1.5 x 0.8: P$1 -0.675,-0.75; P$8 -0.675,0.75 | smd 0.3 x 0.6: P$2 0.375,-0.85; P$3 0.825,-0.85; P$4 1.275,-0.85; P$5 1.275,0.85; P$6 0.825,0.85; P$7 0.375,0.85 | smd 1.73 x 0.4: P$9 -0.79,0
LGA14L = smd 0.45 x 0.25: 1 -1.175,0.75; 2 -1.175,0.25; 3 -1.175,-0.25; 4 -1.175,-0.75; 8 1.175,-0.75; 9 1.175,-0.25; 10 1.175,0.25; 11 1.175,0.75 | smd 0.25 x 0.45: 5 -0.5,-0.925; 6 0,-0.925; 7 0.5,-0.925; 12 0.5,0.925; 13 0,0.925; 14 -0.5,0.925
WSON-12 = smd 0.3 x 0.7: 1 -1.25,-1.05; 2 -0.75,-1.05; 3 -0.25,-1.05; 4 0.25,-1.05; 5 0.75,-1.05; 6 1.25,-1.05; 7 1.25,1.05; 8 0.75,1.05; 9 0.25,1.05; 10 -0.25,1.05; 11 -0.75,1.05; 12 -1.25,1.05 | smd 2 x 0.9: PAD 0,0

### Placement (x,y rotation side)
C1  12.06,36.83 90 top
C2  51.44,29.21 270 top
C3  16.51,39.37 270 top
C4  46.99,20.32 0 top
C5  50.8,39.37 270 top
C6  49.53,22.86 90 top
C7  10.16,36.83 90 top
C8  53.34,29.21 270 top
C9  55.24,1.91 180 top
C10  52.7,5.08 270 top
C11  53.34,7.62 0 top
C12  49.53,10.79 0 top
C13  45.72,10.79 180 top
C14  15.88,29.21 90 top
C15  44.45,13.97 90 top
D1  60.96,12.7 0 top
D2  60.96,10.79 0 top
F1  7.62,3.81 270 top
FD1  61.59,48.9 0 top
FD2  61.59,48.9 0 bottom
FD3  1.91,5.08 0 top
FD4  1.91,5.08 0 bottom
FRAME1  8.89,-36.83 0 top  (outside the outline)
H1  60.96,2.54 0 top
H2  60.96,51.44 0 top
H3  2.54,51.44 0 top
H4  2.54,2.54 0 top
I2C  48.26,24.77 0 bottom
IMU_ADR  44.45,24.77 180 bottom
J1  13.97,8.26 270 top
J3  2.54,27.94 270 top
J4  2.54,38.1 270 top
J5  60.96,38.1 90 top
J6  60.96,27.94 90 top
J7  1.27,16.51 90 top
J8  62.23,21.59 270 top
J9  46.99,48.9 0 top
J12  54.61,48.9 0 top
J13  16.51,48.9 0 top
J14  8.89,48.9 0 top
L1  47.62,5.71 90 top
LOGO1  56.26,10.79 0 top
LOGO3  37.47,41.91 0 bottom
LOGO4  SFE_LOGO_NAME_FLAME.1_INCH  [SFE_LOGO_NAME_FLAME_.1]  49.28,16.64 0 top
MOT_MODE_L/3  12.7,33.02 0 bottom
MOT_MODE_R/4  50.8,33.02 180 bottom
MOT_PWR  60.33,8.26 180 bottom
Q1  14.61,22.23 0 top
Q2  10.79,22.23 0 top
Q3  14.61,19.05 180 top
Q4  10.79,19.05 180 top
Q5  18.41,19.05 180 top
Q6  7.62,8.89 90 top
Q7  18.41,22.23 0 top
R1  47.62,29.21 270 top
R2  49.53,29.21 90 top
R3  46.99,18.41 180 top
R4  57.15,7.62 180 top
R5  53.34,9.53 180 top
R6  13.97,25.4 270 top
R7  17.78,25.4 270 top
R8  60.96,6.35 0 top
R9  10.16,25.4 270 top
R10  15.88,25.4 270 top
R11  12.06,25.4 270 top
R12  7.62,12.95 0 top
R13  7.62,11.3 0 top
R14  17.78,29.21 270 top
R15  10.16,41.91 90 top
R16  12.06,41.91 270 top
R17  54.61,13.97 90 top
R18  8,16.13 90 top
R19  8,21.08 270 top
R20  60.96,8.26 0 top
RESET  12.06,28.57 0 top
S1  3.17,10.16 90 top
SYS_PWR  60.33,10.79 0 bottom
TP1  6.35,27.94 0 bottom
TP2  3.81,26.67 0 bottom
TP3  19.05,31.11 0 bottom
TP4  21.59,30.48 0 bottom
TP5  3.81,38.1 0 bottom
TP6  6.35,36.83 0 bottom
TP7  39.37,23.5 0 bottom
TP8  39.37,26.04 0 bottom
TP9  59.69,27.94 0 bottom
TP10  57.15,29.21 0 bottom
TP11  39.37,36.2 0 bottom
TP12  39.37,38.73 0 bottom
TP13  57.15,38.1 0 bottom
TP14  59.69,39.37 0 bottom
TP15  43.81,46.99 0 bottom
TP16  43.81,50.16 0 bottom
TP17  47.62,48.26 0 bottom
TP18  48.9,45.72 0 bottom
TP19  54.61,48.26 0 bottom
TP20  55.88,45.72 0 bottom
TP21  15.88,45.72 0 bottom
TP22  8.89,45.72 0 bottom
TP23  10.16,48.26 0 bottom
TP24  17.14,48.26 0 bottom
TP25  5.08,31.75 0 bottom
TP26  7.62,31.75 0 bottom
TP27  7.62,34.29 0 bottom
TP28  5.08,34.29 0 bottom
TP29  55.88,31.75 0 bottom
TP30  58.42,34.29 0 bottom
TP31  58.42,31.75 0 bottom
TP32  55.88,34.29 0 bottom
TP33  6.35,25.4 0 bottom
TP34  8.89,13.97 0 bottom
TP35  58.42,6.35 0 bottom
TP36  55.88,6.35 0 bottom
TP37  50.8,16.51 0 bottom
TP38  45.09,19.68 0 bottom
TP39  50.8,22.86 0 bottom
U1  31.75,27.3 180 top
U2  55.24,5.08 90 top
U4  46.99,22.86 0 top
U5  11.43,33.02 270 top
U6  52.07,33.02 90 top
U$1  [#MOTOR_3#0]  8.26,27.94 90 top
U$2  [#SERVO_2#0]  57.53,19.05 270 top
U$3  [#11V_MAX###0]  19.3,4.45 90 top
U$4  [#GND#0]  4.32,25.4 0 top
U$5  [#POWER#0]  13.97,16.51 0 top
U$6  [PWR0]  58.67,11.68 270 top
U$7  [RESET0]  12.06,30.73 0 top
U$8  [#MOTOR_R#0]  55.24,38.1 270 top
U$9  [#MR##0]  59.18,35.56 0 top
U$10  [#MOTOR_L#0]  8.26,38.1 90 top
U$11  [#SERVO_1#0]  5.97,19.05 90 top
U$12  [#MOTOR_4#0]  55.24,27.94 270 top
U$13  [#VIN_MEAS#0]  14.35,40.64 0 bottom
U$14  [#MR##1]  59.18,36.58 0 top
U$15  [#3V3#0]  4.32,28.45 0 top
U$16  [#ML##0]  4.32,40.64 0 top
U$17  [#3V3#4]  59.18,37.59 0 top
U$18  [#M4##0]  59.18,25.4 0 top
U$19  [#M4##5]  59.18,26.42 0 top
U$20  [#IO0#0]  4.32,27.43 0 top
U$21  [#IO1#0]  4.32,26.42 0 top
U$22  [#IO5#0]  4.32,36.58 0 top
U$23  [#IO4#0]  4.32,37.59 0 top
U$24  [#GND#0]  4.32,35.56 0 top
U$25  [#3V3#0]  4.32,38.61 0 top
U$26  [#GND_#0]  1.27,16.51 0 bottom
U$27  [#5V_#0]  1.52,19.05 0 bottom
U$28  [#IO8#0]  59.18,28.45 0 top
U$29  [#IO9#0]  59.18,29.46 0 top
U$30  [#GND#10]  59.18,40.64 0 top
U$31  [#GND#10]  59.18,30.48 0 top
U$32  [#ML##1]  4.32,39.62 0 top
U$33  [#3V3#4]  59.18,27.43 0 top
U$34  [#IO12#0]  59.18,38.61 0 top
U$35  [#IO13#0]  59.18,39.62 0 top
U$36  [ORDERING_INSTRUCTIONS]  71.12,50.8 0 top  (outside the outline)
U$37  [#PH#0]  3.43,43.81 90 top
U$38  [#IO27#0]  10.41,49.15 90 top
U$39  [#IO28#0]  18.03,49.15 90 top
U$40  [#GND#10]  7.37,49.15 90 top
U$41  [#3V3#4]  8.38,49.15 90 top
U$42  [#GND#10]  14.99,49.15 90 top
U$43  [#3V3#4]  16,49.15 90 top
U$44  [#IO26#0]  9.4,49.15 90 top
U$45  [#IO22#0]  17.02,49.15 90 top
U$46  [#IO18#0]  47.5,49.15 270 top
U$47  [#IO19#0]  48.51,49.15 270 top
U$48  [#IO20#0]  55.12,49.15 270 top
U$49  [#IO21#0]  56.13,49.15 270 top
U$50  [#GND#0]  53.09,49.15 270 top
U$51  [#3V3#0]  54.1,49.15 270 top
U$52  [#GND#0]  45.47,49.15 270 top
U$53  [#3V3#0]  46.48,49.15 270 top
U$54  [#GND#0]  2.16,16.51 0 top
U$55  [#5V#0]  2.16,19.05 0 top
U$56  [#IO16#0]  2.16,21.59 0 top
U$57  [#GND#10]  61.34,16.51 0 top
U$58  [#IO17#0]  61.34,21.59 0 top
U$59  [#5V#18]  61.34,19.05 0 top
U$60  [#I2C#0]  49.53,24.77 0 bottom
U$61  [#IO16_#0]  1.27,21.59 0 bottom
U$62  [ON0]  0.89,12.83 90 top
U$63  [OFF0]  0.89,7.24 90 top
U$64  [#IMU_ADR#0]  43.56,24.77 0 bottom
U$65  [#EN#0]  4.7,43.81 90 top
U$66  [#MOT_MODE_L#3#0]  13.46,33.02 0 bottom
U$67  [SYS0]  61.09,13.97 0 top
U$68  [IO220]  46.35,13.97 270 top
U$69  [#RANGE#0]  54.61,45.21 0 top
U$70  [#MOT_MODE_R#4#0]  50.04,33.02 0 bottom
U$71  [MOT0]  61.09,9.53 0 top
U$72  [XRP_URL_3MM]  45.47,35.18 270 top
U$73  [#PWR#0]  62.23,9.53 90 bottom
U$74  [#LINE#0]  8.89,45.09 0 top
U$75  [#_GND#0]  62.23,16.51 0 bottom
U$76  [#_5V#0]  61.98,19.05 0 bottom
U$77  [#_IO17#0]  62.23,21.59 0 bottom
U$78  [POLARITY_MARKING_CENTER_POSITIVE#JPG]  5.21,3.17 270 top
U$79  [X0]  51.18,19.56 0 bottom
U$80  [Y0]  56.13,21.72 0 bottom
U$81  [Z0]  53.98,23.5 0 bottom
U$82  [#EXTRA#0]  16.51,45.09 0 top
U$83  [USER0]  52.7,13.97 270 top
U$84  [#USER_BTN#0]  28.19,29.84 0 bottom
U$85  [0X6B0]  39.88,22.35 0 bottom
U$86  [0X6A0]  39.88,21.08 0 bottom
U$87  [OPEN#0]  38.61,21.08 0 bottom
U$88  [X0]  55.5,19.81 0 top
U$89  [Y0]  50.8,22.23 0 top
U$90  [Z0]  55.37,22.73 0 top
U$91  [CLOSED#0]  38.61,22.35 0 bottom
U$92  [XRP_FULL_LOGO]  37.85,6.99 0 bottom
U$93  [#VUSB#0]  14.73,4.45 0 bottom
U$94  [#M3##0]  4.32,30.48 0 top
U$95  [#MOT#0]  59.44,8.26 0 bottom
U$96  [#SYS#0]  59.44,10.79 0 bottom
U$97  [XRP_URL_5MM]  20.57,22.73 0 bottom
U$98  46.99,45.21 0 top
U$99  [#M3##4]  4.32,29.46 0 top
U$100  [#ML#0]  2.16,47.75 90 top
U$101  [#M3#0]  2.16,45.85 90 top
U$102  [100]  60.07,43.81 270 top
U$103  [110]  58.8,43.81 270 top
U$104  [140]  60.07,45.72 270 top
U$105  [150]  58.8,45.72 270 top
U$106  [#MR#0]  61.34,45.59 270 top
U$107  [#M4#0]  61.34,43.69 270 top
U$108  [20]  3.43,45.72 90 top
U$109  [30]  4.7,45.72 90 top
U$110  [60]  3.43,47.62 90 top
U$111  [70]  4.7,47.62 90 top
U$114  [MOTOR_IO0]  0.89,46.35 90 top
U$115  [MOTOR_IO0]  62.61,45.09 270 top
U$116  [#EN#0]  58.8,47.62 270 top
U$117  [#PH#0]  60.07,47.62 270 top
USER  49.53,13.97 180 top
USER_BTN  27.3,29.84 0 bottom
VIN_MEAS  15.24,40.64 0 bottom
VUSB  13.97,4.45 180 bottom

### Tracks (layer width: path | path; a pad name or v marks a point on that pad's centre or on a via)
3.3V  (via drill 0.3)
  Top 0.254: C1.1 11.68,36.36 11.68,36.62 11.18,37.12 11.18,38.35 v10.16,39.37 | C2.1 52.32,29.17 v52.32,26.67 52.32,23.11 51.22,22.01 C6.1 | U4.5 46.49,20.67 C4.1 47.16,19.3 49.53,19.3 | 49.53,19.3 C6.1 | C6.1 49.43,22.11 U4.8 | D1.A 56.73,12.7 R17.2 53.59,15.84 53,15.84 49.53,19.3
  Top 0.508: U1.36 24.77,13.34 26.67,15.24 v26.67,24.77 | J3.3 3.14,28.48 2.54,29.08 v2.54,29.21 | J4.3 3.14,38.64 2.54,39.24 v2.54,39.37 | J5.3 60.36,37.56 60.96,36.96 v60.96,36.83 | J6.3 60.36,27.4 60.96,26.8 v60.96,26.67 | J14.2 8.39,50.94 v8.89,51.44 | v16.51,51.44 16.01,50.94 J13.2 | J9.2 46.49,50.94 v46.99,51.44 | J12.2 54.11,50.94 v54.61,51.44
  Bottom 0.254: v10.16,39.37 v2.54,39.37 | I2C.2 48.26,26.67 | v12.06,34.92 12.18,34.81 MOT_MODE_L/3.2 | v51.44,31.11 51.32,31.23 MOT_MODE_R/4.2 | IMU_ADR.2 44.97,26.66 44.96,26.67
  Bottom 0.508: v16.51,51.44 v8.89,51.44 2.54,45.09 v2.54,39.37 1.78,38.61 1.78,29.97 v2.54,29.21 1.78,28.45 1.78,26.16 2.54,25.4 TP33.1 26.04,25.4 v26.67,24.77 41.91,24.77 43.81,26.67 44.96,26.67 48.26,26.67 v52.32,26.67 v60.96,26.67 61.72,27.43 61.72,36.07 v60.96,36.83 61.72,37.59 61.72,44.32 v54.61,51.44 v46.99,51.44
  pour Top (no thermals): 11.68,36.32 11.68,34.92 12.32,34.29 12.7,34.29 12.7,34.42 12.45,34.67 12.45,36.32
  pour Top (no thermals): 51.82,29.72 51.82,31.11 51.18,31.75 50.8,31.75 50.8,31.62 51.05,31.37 51.05,29.72
5V  (via drill 0.3)
  Top 0.254: Q7.1 17.77,21 18.41,20.34 Q5.3 | D2.A 58.81,12.06 56.39,12.06 v55.82,12.64
  Bottom 0.635: v47.62,10.79 36.2,10.79 30.48,16.51 v19.05,16.51 v18.41,16.51 10.29,16.51 9.02,17.78 2.67,17.78 J7.2 | v47.62,10.16 v47.62,10.79 | v47.62,11.43 v47.62,10.79 | J8.2 62.1,18.92 v55.82,12.64 53.98,10.79 v47.62,10.79
  pour Top (isolate 0.178, no thermals): 53.09,7.49 53.09,10.03 49.91,10.03 48.26,11.68 46.99,11.68 45.85,10.54 45.85,7.49
  pour Bottom (isolate 0.178): 46.74,11.05 47.37,11.68 47.88,11.68 48.51,11.05 48.51,10.54 47.88,9.91 47.37,9.91 46.74,10.54
  pour Top (isolate 0.178, no thermals): 18.1,16.45 18.29,16.26 19.18,16.26 19.3,16.38 19.3,16.64 18.73,17.21 18.73,18.29 18.1,18.29
5V_EN  (via drill 0.3)
  Top 0.254: U2.P$2 v57.14,5.46 v57.15,5.46
  Bottom 0.254: v57.15,5.46 57.28,5.46 58.17,6.35 TP35.1
5V_PG  (via drill 0.3)
  Top 0.254: U2.P$5 54.27,6.36 54.14,6.48 53.84,6.48 v53.72,6.6
  Bottom 0.254: v53.72,6.6 54.36,6.6 54.61,6.35 TP36.1
!POW_EN!
  Top 0.254: R13.1 6.77,10.71 5.47,9.41 S1.2
!RP_RESET!  (via drill 0.3)
  Top 0.254: U1.30 v19.68,28.57 | RESET.4 RESET.3 14.66,28.83 v14.73,28.83 15.2,28.36 C14.1
  Bottom 0.254: v19.68,28.57 14.99,28.57 v14.73,28.83
BOOTSEL  (via drill 0.3)
  Top 0.254: v35.56,16.51 34.45,16.51 U1.46
  Bottom 0.254: v35.56,16.51 TP37.1
FB
  pour Top (isolate 0.178, no thermals): 53.59,10.03 54.99,10.03 56.9,8.13 56.9,7.11 55.88,7.11 55.5,6.73 55.5,5.97 56.26,5.97 56.26,5.84 55.24,5.84 53.59,7.49
GND  (via drill 0.3)
  Top 0.254: U4.7 47.49,21.21 46.99,21.21 U4.6 | v11.43,34.29 11.05,34.67 11.05,36.58 10.54,37.08 10.54,37.3 C7.2 | U4.2 45.31,23.11 45.09,22.88 45.09,22.61 | 45.09,22.61 v45.09,22.23 | U4.3 45.09,22.61
  Bottom 0.254: SYS_PWR.1 60.85,10.3 59.8,9.26 MOT_PWR.1
  other vias: 11.43,31.75 52.07,31.75 52.07,34.29 48.9,20.32 39.37,53.34 24.13,53.34 25.4,43.18 38.1,43.18 33.02,43.18 59.05,53.34 62.87,49.53 62.87,4.45 59.05,0.64 4.45,0.64 0.64,4.45 0.64,49.53 4.45,53.34 59.05,49.53 59.05,4.45 4.45,4.45 4.45,49.53 0.64,33.02 0.64,25.4 0.64,40.64 3.43,44.7 15.24,53.34 10.16,53.34 53.34,53.34 48.26,53.34 62.87,40.64 62.87,33.02 62.87,25.4 26.04,8.89 19.68,8.89 24.77,34.29 19.68,46.35 44.45,31.75 43.81,19.68 43.81,6.99 32.38,7.62 36.2,3.43 14.99,41.91 17.78,41.91 12.06,39.37 9.14,36.83 49.53,40.64 52.07,40.64 51.44,25.91 53.34,25.91 50.8,24 45.72,25.91 46.35,29.97 52.7,0.64 55.24,0.64 53.98,3.17 57.15,6.35 57.78,9.53 51.44,12.06 43.81,12.06 45.09,8.26 43.81,9.53 45.09,5.71 46.35,6.86 44.7,3.17 50.16,0.64 47.62,0.64 45.09,0.64 55.24,10.79 3.81,34.29 3.81,24.13 59.69,41.91 59.69,31.75 28.57,34.29 28.57,28.57 13.34,49.53 7.62,51.44 52.07,49.53 45.72,51.44 31.11,28.57 34.29,28.83 31.11,26.67 28.57,26.67 33.66,26.67 38.1,39.37 26.04,38.1 15.24,34.29 14.61,30.48 47.62,31.75 47.62,34.92 47.62,40.64 57.15,43.18 53.34,43.18 50.16,31.11 26.04,26.67 26.04,28.57 34.29,34.29 31.75,22.86 29.21,17.78 57.15,33.02 6.35,33.02 46.35,12.06 49.02,12.06 46.35,4.57 48.9,4.57 48.9,6.86 47.62,5.71 50.16,5.71 51.44,6.86 43.81,4.45 12.7,20.32 16.51,20.32 19.94,20.95 7.37,21.08 8.26,24.13 12.06,28.57 19.05,24.13 39.37,20.95 6.35,7.62 8.89,8.89 6.99,4.45 8.26,4.45 10.79,5.71 18.41,15.24 15.88,17.78 19.68,17.78 24.77,29.21 37.47,34.29 38.1,29.84 38.1,26.04 39.37,22.23 0.64,43.18 17.78,39.37 17.78,34.92 9.14,34.54 10.79,0.64 20.95,0.64 28.57,0.64 34.92,0.64 42.55,0.64 33.02,12.06 34.29,17.78 26.04,13.34 24.77,14.61 26.29,3.43 24.77,5.71 29.84,15.24 24.77,20.95 31.11,38.1 54.36,31.5 54.36,29.21 50.16,19.68 49.53,18.29 56.52,14.61 53.98,12.06 46.35,43.94 60.96,20.32 2.54,20.32 3.81,31.75 59.69,34.29 7.24,26.29 15.88,12.7 43.81,27.56 38.73,8.89 13.97,46.35 6.35,47.62 16.83,29.21 8.89,41.91 3.81,41.91 9.14,31.5 54.36,34.54 7.62,4.45 35.56,12.7 39.37,50.16 24.13,50.16 24.13,47.62 24.13,45.09 39.37,47.62 39.37,45.09 27.94,43.18 30.48,43.18 35.56,43.18 38.1,13.34 26.04,40.01 24.77,17.78 58.42,24.13 10.16,12.7 5.08,10.79 5.08,15.24 8,16.13 6.35,22.86 11.81,17.78 13.59,17.78 8.64,16.13 7.37,16.13 8,21.08 8.64,21.08 50.8,21.34 13.21,43.81 36.2,8.89 57.78,13.34 53.34,13.97 32.38,15.88 49.53,14.61 53.98,16.51 3.17,5.71
  pour Bottom (isolate 0.178, rank 2): 0,53.98 0,0 63.5,0 63.5,53.98
  pour Top (isolate 0.178, rank 2): 63.5,53.98 63.5,0 0,0 0,53.98
IMU_INT1  (via drill 0.3)
  Top 0.254: U4.4 45.81,21.6 45.09,20.87 TP38.1
  other vias: 45.09,19.68
IMU_INT2  (via drill 0.3)
  Top 0.254: U4.9 48.52,22.61 48.77,22.86 TP39.1
  other vias: 50.8,22.86
MOT_3+  (via drill 0.3)
  Top 0.254: TP25.1 5.71,31.11
  Top 0.305: J3.1 5.08,30.48 5.71,31.11 7.37,32.77 U5.4
  other vias: 5.08,31.75
MOT_3-  (via drill 0.3)
  Top 0.305: J3.2 5.35,29.48 TP26.1 8.14,32.27 U5.5
  other vias: 7.62,31.75
MOT_4+  (via drill 0.3)
  Top 0.305: U6.2 55.36,32.27 TP29.1 57.15,30.48 57.15,26.67 58.42,25.4 J6.1
  other vias: 55.88,31.75
MOT_4-  (via drill 0.3)
  Top 0.254: TP31.1 57.78,31.11
  Top 0.305: J6.2 58.69,26.4 58.42,26.67 58.42,30.48 57.78,31.11 56.13,32.77 U6.3
  other vias: 58.42,31.75
MOT_L+  (via drill 0.3)
  Top 0.305: J4.1 5.08,40.64 6.35,39.37 6.35,35.56 TP27.1 8.14,33.77 U5.2
  other vias: 7.62,34.29
MOT_L-  (via drill 0.3)
  Top 0.254: TP28.1 5.71,34.92
  Top 0.305: J4.2 4.81,39.64 5.08,39.37 5.08,35.56 5.71,34.92 7.37,33.27 U5.3
  other vias: 5.08,34.29
MOT_R+  (via drill 0.3)
  Top 0.254: TP30.1 57.78,34.92
  Top 0.305: J5.1 58.42,35.56 57.78,34.92 56.13,33.27 U6.4
  other vias: 58.42,34.29
MOT_R-  (via drill 0.3)
  Top 0.305: J5.2 58.15,36.56 TP32.1 55.36,33.77 U6.5
  other vias: 55.88,34.29
N$1
  Top 0.254: D1.C 62.74,11.8 62.74,7.28 R8.2
N$2  (via drill 0.3)
  Top 0.254: U4.1 45.07,23.61 v44.45,22.99 44.45,19.34 45.38,18.41 R3.2
  Bottom 0.254: IMU_ADR.1 43.93,23.51 v44.45,22.99
N$3  (via drill 0.3)
  Top 0.254: v46.99,25.91 47.62,26.54 R1.2
  Bottom 0.254: I2C.3 47.22,25.68 v46.99,25.91
N$4  (via drill 0.3)
  Top 0.254: v49.53,25.91 R2.1
  Bottom 0.254: I2C.1 49.3,25.68 v49.53,25.91
N$5
  Top 0.254: C10.1 52.73,5.91 U2.P$6
N$6
  Top 0.254: Q1.6 13.96,24.54 R6.2 14.61,23.91 Q1.5 Q1.2
N$7
  Top 0.254: Q3.1 15.26,20.35 Q1.3 15.97,21.43 16.51,21.96 16.51,23.91 R10.2
N$8
  Top 0.635: F1.1 7.62,7.79 Q6.3
N$9  (via drill 0.3)
  Top 0.635: U1.40 v17.78,3.17 v17.14,3.17
  Bottom 0.635: v17.78,3.17 v17.14,3.17 15.88,4.45 VUSB.2
N$10  (via drill 0.3)
  Top 0.254: R8.1 59.98,6.35 58.85,7.48 58.85,9.58 v58.93,9.65
  Bottom 0.254: SYS_PWR.2 59.8,10.54 58.93,9.66 v58.93,9.65
N$11
  Top 0.254: Q2.2 Q2.5 10.79,23.91 R9.2 10.14,24.54 Q2.6
N$12  (via drill 0.3)
  Top 0.254: R15.2 R16.1 12.87,42.76 v13.46,42.16
  Bottom 0.254: VIN_MEAS.2 14.72,40.91 v13.46,42.16
N$13  (via drill 0.3)
  Top 0.254: U5.11 13.45,33.77 v13.97,34.29
  Bottom 0.254: MOT_MODE_L/3.1 13.22,33.41 13.97,34.16 v13.97,34.29
N$14  (via drill 0.3)
  Top 0.254: U6.11 50.05,32.27 v49.53,31.75
  Bottom 0.254: v49.53,31.75 49.53,31.88 50.28,32.63 MOT_MODE_R/4.1
N$15
  Top 0.254: R12.1 6.82,12.95 R13.2 7.62,10.45 7.62,8.89 8.57,7.94 Q6.1
N$16
  Top 0.254: Q4.1 11.45,20.35 Q2.3 12.16,21.43 12.7,21.96 12.7,23.91 R11.2
N$17  (via drill 0.3)
  Top 0.254: C15.1 44.5,13.17 v45.72,13.17 USER.3 USER.4 54.56,13.17 R17.1 | v32.38,30.48 v32.38,17.78
  Bottom 0.254: USER_BTN.1 28.57,29.84 29.21,30.48 v32.38,30.48 | v32.38,17.78 36.2,13.97 44.92,13.97 v45.72,13.17
N$18  (via drill 0.3)
  Top 0.635: R19.1 7.49,22.48 6.35,21.34 v6.35,14.73 | v6.35,14.1 v6.35,14.73 | R18.1 v6.35,14.73
  Bottom 0.635: v6.35,14.73 v6.35,14.1 6.35,8.89 10.79,4.45 VUSB.1
N$19
  Top 0.254: Q7.2 Q7.5 18.41,23.91 R7.2 17.77,24.54 Q7.6
N$20
  Top 0.254: Q5.1 19.07,20.35 Q7.3 19.23,21.59 19.82,21.59 20.17,21.94 20.17,25.97 R14.2
N$21
  Top 0.254: D2.C 61.84,8.28 R20.2
N$22  (via drill 0.3)
  Top 0.254: R20.1 61.09,9.23 v61.09,9.53
  Bottom 0.254: v61.09,9.53 61.09,9.51 60.85,9.27 MOT_PWR.2
RP_IO0/ENC_3_A  (via drill 0.3)
  Top 0.254: v34.29,27.94 34.29,19.56 36.83,17.02 36.83,7.75 39.37,5.21 39.37,4.48 40.68,3.17 U1.1 | v2.54,27.94 2.79,27.94 3.25,27.48 J3.4
  Bottom 0.254: v34.29,27.94 TP1.1 v2.54,27.94
RP_IO1/ENC_3_B  (via drill 0.3)
  Top 0.254: v34.92,27.3 34.92,19.94 37.47,17.4 37.47,8.26 39.37,6.35 40.8,6.35 U1.2 | v2.54,26.67 2.73,26.48 J3.5
  Bottom 0.254: v34.92,27.3 7.23,27.3 6.59,26.67 TP2.1 v2.54,26.67
RP_IO2/MOT_3_PH  (via drill 0.3)
  Top 0.254: v35.56,31.75 35.56,20.32 38.1,17.78 38.1,14.73 39.37,13.46 39.37,12.06 40.64,10.79 U1.4 | v14.61,31.75 13.97,31.75 13.45,32.27 U5.8
  Bottom 0.254: v14.61,31.75 18.41,31.75 TP3.1 19.68,31.75 v35.56,31.75
RP_IO3/MOT_3_EN  (via drill 0.3)
  Top 0.254: v36.2,31.11 36.2,20.83 38.73,18.29 38.73,15.24 40.64,13.34 U1.5 | v15.24,31.11 13.97,31.11 13.31,31.77 U5.7
  Bottom 0.254: v15.24,31.11 17.14,31.11 18.41,29.84 20.95,29.84 TP4.1 22.23,31.11 v36.2,31.11
RP_IO4/ENC_L_A  (via drill 0.3)
  Top 0.254: v35.56,37.47 35.56,33.02 36.83,31.75 36.83,21.08 39.37,18.54 39.37,17.18 40.68,15.88 U1.6 | v2.54,38.1 2.79,38.1 3.25,37.64 J4.4
  Bottom 0.254: v35.56,37.47 22.23,37.47 20.95,38.73 4.45,38.73 TP5.1 v2.54,38.1
RP_IO5/ENC_L_B  (via drill 0.3)
  Top 0.254: v36.2,36.83 36.2,33.66 37.47,32.38 37.47,21.34 39.75,19.05 40.8,19.05 U1.7 | v2.54,36.83 2.73,36.64 J4.5
  Bottom 0.254: v36.2,36.83 21.59,36.83 20.32,38.1 7.62,38.1 TP6.1 v2.54,36.83
RP_IO6/MOT_L_PH  (via drill 0.3)
  Top 0.254: v14.61,33.02 13.97,33.02 13.72,33.27 U5.10 | v38.73,31.75 38.73,24.13 TP7.1 U1.9
  Bottom 0.254: v38.73,31.75 37.47,33.02 v14.61,33.02
  other vias: 39.37,23.5
RP_IO7/MOT_L_EN  (via drill 0.3)
  Top 0.254: v15.24,32.38 13.97,32.38 13.59,32.77 U5.9 | v39.37,29.84 TP8.1 U1.10
  Bottom 0.254: v39.37,29.84 36.83,32.38 v15.24,32.38
  other vias: 39.37,26.04
RP_IO8/ENC_4_A  (via drill 0.3)
  Top 0.254: v60.96,27.94 60.71,27.94 60.25,28.4 J6.4 | v43.81,28.57 U1.11
  Bottom 0.254: v43.81,28.57 45.09,27.3 59.05,27.3 TP9.1 v60.96,27.94
RP_IO9/ENC_4_B  (via drill 0.3)
  Top 0.254: v60.96,29.21 60.77,29.4 J6.5 | U1.12 42.29,31.11 44.2,29.21 v44.45,29.21
  Bottom 0.254: v44.45,29.21 45.72,27.94 55.88,27.94 TP10.1 v60.96,29.21
RP_IO10/MOT_4_PH  (via drill 0.3)
  Top 0.254: U6.10 44.83,32.77 43.81,33.78 43.81,34.76 42.38,36.2 U1.14 TP11.1
  other vias: 39.37,36.2
RP_IO11/MOT_4_EN  (via drill 0.3)
  Top 0.254: U6.9 45.47,33.27 44.45,34.29 44.45,36.45 42.16,38.73 U1.15 TP12.1
  other vias: 39.37,38.73
RP_IO12/ENC_R_A  (via drill 0.3)
  Top 0.254: v60.96,38.1 60.71,38.1 60.25,38.56 J5.4 | v43.81,38.1 43.81,39.66 42.2,41.27 U1.16
  Bottom 0.254: v43.81,38.1 TP13.1 v60.96,38.1
RP_IO13/ENC_R_B  (via drill 0.3)
  Top 0.254: v60.96,39.37 60.77,39.56 J5.5 | U1.17 42.2,43.81 44.45,41.57 v44.45,38.73
  Bottom 0.254: v44.45,38.73 56.26,38.73 56.9,39.37 TP14.1 v60.96,39.37
RP_IO14/MOT_R_PH  (via drill 0.3)
  Top 0.254: U6.8 46.11,33.77 45.09,34.8 45.09,42.55 43.81,43.81 TP15.1 43.81,47.24 42.16,48.9 U1.19
  other vias: 43.81,46.99
RP_IO15/MOT_R_EN  (via drill 0.3)
  Top 0.254: U6.7 46.76,34.27 45.72,35.31 45.72,43.18 44.45,44.45 44.45,49.53 TP16.1 43.56,50.16 42.93,50.8 42.08,50.8 U1.20
  other vias: 43.81,50.16
RP_IO16/S1_OUT  (via drill 0.3)
  Top 0.254: v29.21,39.37 29.84,38.73 v29.84,22.86 | U1.21 21.17,51.44 19.9,50.16 v19.68,50.16
  Bottom 0.254: J7.3 3.05,23.5 29.21,23.5 v29.84,22.86 | v29.21,39.37 24.13,39.37 22.86,40.64 22.86,46.99 v19.68,50.16
RP_IO17/S2_OUT  (via drill 0.3)
  Top 0.254: v32.38,38.73 33.02,38.1 v33.02,21.59 | v19.68,48.9 U1.22
  Bottom 0.254: v33.02,21.59 49.53,21.59 50.42,20.7 51.18,20.7 52.07,21.59 J8.1 | v32.38,38.73 23.5,38.73 22.23,40.01 22.23,46.35 v19.68,48.9
RP_IO18/SDA  (via drill 0.3)
  Top 0.254: v46.99,31.11 46.99,30.7 R1.1 46.35,28.79 46.35,24.77 46.49,24.63 U4.14 | v46.99,35.56 v46.99,43.18 47.49,43.68 J9.3 | v24.77,42.55 24.13,42.55 22.86,43.81 U1.24
  Bottom 0.254: v46.99,35.56 v46.99,31.11 | v24.77,42.55 42.55,42.55 43.18,43.18 v46.99,43.18 47.62,43.81 TP17.1
RP_IO19/SCL  (via drill 0.3)
  Top 0.254: v25.4,41.91 24.47,41.91 23.84,41.27 U1.25 | v48.26,31.11 48.48,31.11 R2.2 48.64,29.17 48.64,25.91 46.99,24.26 U4.13 | v48.26,35.56 v48.26,43.18 48.49,43.41 J9.4
  Bottom 0.254: v48.26,31.11 v48.26,35.56 | v25.4,41.91 43.18,41.91 43.81,42.55 47.62,42.55 v48.26,43.18 48.9,43.81 TP18.1
RP_IO20/RANGE_TRIG  (via drill 0.3)
  Top 0.254: v24.77,41.27 24.77,40.68 22.82,38.73 U1.26 | J12.3 55.11,43.68 v54.61,43.18
  Bottom 0.254: v24.77,41.27 43.81,41.27 44.45,41.91 53.34,41.91 v54.61,43.18 TP19.1
RP_IO21/RANGE_ECHO  (via drill 0.3)
  Top 0.254: U1.27 22.82,36.2 25.4,38.77 v25.4,40.64 | v55.88,43.18 56.11,43.41 J12.4
  Bottom 0.254: v25.4,40.64 44.45,40.64 45.09,41.27 53.98,41.27 v55.88,43.18 TP20.1
RP_IO22/USER_BTN  (via drill 0.3)
  Top 0.254: J13.3 17.01,46.49 v19.43,44.07 19.56,43.94 19.56,31.5 19.94,31.11 U1.29 24.13,31.11 v24.77,30.48
  Bottom 0.254: v19.43,44.07 17.53,44.07 TP21.1 | USER_BTN.2 25.4,29.84 v24.77,30.48
RP_IO26/LINE_L  (via drill 0.3)
  Top 0.254: U1.31 21.17,26.04 18.57,28.64 18.57,42.39 16.51,44.45 v12.06,44.45 11.43,44.45 9.39,46.49 J14.3
  Bottom 0.254: v12.06,44.45 10.16,44.45 TP22.1
RP_IO27/LINE_R  (via drill 0.3)
  Top 0.254: U1.32 22.86,23.5 24.13,24.77 24.13,29.46 23.75,29.84 19.68,29.84 19.05,30.48 19.05,43.18 16.51,45.72 v12.06,45.72 11.43,45.72 10.39,46.76 J14.4
  Bottom 0.254: v12.06,45.72 12.06,46.35 TP23.1
RP_IO28/VIN_MEAS  (via drill 0.3)
  Top 0.254: U1.34 24.13,18.41 25.4,19.68 25.4,30.86 23.88,32.38 20.32,32.38 20.07,32.64 20.07,39.88 v20.19,40.01 20.07,40.13 20.07,44.7 v19.05,45.72 18.01,46.76 J13.4
  Bottom 0.254: v19.05,45.72 19.05,46.35 TP24.1 | VIN_MEAS.1 19.56,40.64 v20.19,40.01
SW
  pour Top (no thermals): 55.37,4.32 55.12,4.32 55.12,4.45 54.74,4.83 54.36,4.83 51.56,2.03 45.97,2.03 45.85,2.16 45.85,3.81 45.97,3.94 51.18,3.94 52.83,5.59 54.99,5.59 55.37,5.21
V_BATT
  Top 0.254: Q1.1 13.96,21.03 14.61,20.38 Q3.3
  Top 0.762: Q3.3 14.61,14.86 J1.PWR
  Bottom 0.254: J1.PWR 10.41,14.22 10.16,13.97 TP34.1
V_POW  (via drill 0.3)
  Top 0.254: Q1.4 15.26,22.84 v15.88,22.23 | v12.06,22.23 11.45,22.84 Q2.4
  Top 0.635: v13.34,19.05 12.7,18.41 12.7,17.02 8.64,12.95 | 8.64,12.95 R12.2 | Q6.2 8.82,9.84 9.65,10.67 9.65,11.94 8.64,12.95
  Bottom 0.254: v13.97,19.05 13.97,21.59 | v15.88,22.23 14.61,22.23 13.97,21.59 | v12.06,22.23 13.34,22.23 13.97,21.59
  Bottom 0.635: v13.97,19.05 v13.34,19.05 v10.16,19.05 v9.53,19.05
  pour Top (isolate 0.178, no thermals): 13.21,18.8 14.1,18.8 14.22,18.92 14.22,19.3 13.97,19.56 13.97,20.45 13.34,20.45 13.34,19.56 13.08,19.3 13.08,18.92
  pour Top (isolate 0.178, no thermals): 9.4,18.8 10.29,18.8 10.41,18.92 10.41,19.3 10.16,19.56 10.16,20.45 9.53,20.45 9.53,19.56 9.27,19.3 9.27,18.92
V_SYS  (via drill 0.3)
  Top 0.254: Q7.4 19.07,22.69 v19.53,22.23
  Top 0.508: Q5.2 17.46,19.36 v17.78,19.05 17.14,18.41 17.14,13.4 16.76,13.02 16.76,9.53 17.78,8.51 17.78,6.6 18.67,5.71 U1.39
  Bottom 0.254: v17.78,19.05 17.78,20.47 v19.53,22.23
V_USB
  Top 0.254: Q2.1 10.14,21.03 10.79,20.38 Q4.3
  Top 0.635: R19.2 R18.2 8.42,17.95 Q4.3
VIN  (via drill 0.3)
  Top 0.254: R16.2 13.17,41.06 16.51,37.72 C3.+
  Top 0.508: 16.37,36.83 C3.+ 16.65,36.83 | 50.94,36.83 C5.+ 50.66,36.83
  Top 0.635: v15.24,36.83 16.37,36.83 | 16.65,36.83 v17.53,36.83 | 50.94,36.83 v52.07,36.83 | 50.66,36.83 v49.53,36.83 | v27.3,35.56 27.3,34.04 27.36,33.98 27.36,32.05 27.3,32 27.3,26.04 27.94,25.4 27.94,14.73 27.3,14.1 v27.3,1.91
  Bottom 0.635: v10.16,34.92 12.06,36.83 v15.24,36.83 v17.53,36.83 19.05,36.83 20.32,35.56 v26.67,35.56 v27.3,35.56 v27.94,35.56 38.1,35.56 38.73,34.92 40.01,34.92 41.91,36.83 v49.53,36.83 v52.07,36.83 53.34,35.56 v53.34,31.11 | v57.15,3.81 v57.15,3.17 v57.15,2.54 56.52,1.91 36.2,1.91 34.29,3.81 29.21,3.81 v27.3,1.91 v26.67,1.91 v26.04,1.91 9.53,1.91 v8.26,3.17 v7.62,3.17 v6.99,3.17
  pour Top (no thermals): 52.96,31.88 52.96,29.72 53.72,29.72 53.72,31.88
  pour Top (no thermals): 10.54,34.16 10.54,36.32 9.78,36.32 9.78,34.16
  pour Top (no thermals): 6.22,0.64 6.22,2.79 6.86,3.43 8.38,3.43 9.02,2.79 9.02,0.64
  pour Top (isolate 0.178, no thermals): 55.75,5.08 55.75,1.27 56.52,1.27 57.66,2.41 57.66,5.08
  pour Top (isolate 0.178): 28.19,35.69 28.07,35.81 26.54,35.81 26.42,35.69 26.42,35.43 27.05,34.8 27.56,34.8 28.19,35.43
  pour Top (isolate 0.178): 25.78,1.78 25.91,1.65 27.43,1.65 27.56,1.78 27.56,3.3 27.05,3.3 25.78,2.03

### Text on the board
Bottom: v10
bPlace: v10
Measures: Units: inches
tDocu: Solder Mask: Red / Thickness: 1.6mm / Two layer design / Finish: Lead Free HASL | Dryw Wade